# Altium project S7CAS-PLEIADES-CARTE-MERE_P06.PrjPcb (part 4 of 4)

## Sheet S7CAS-PLEIADES-CARTE-MERE_P06_DAC.SchDoc
size Tabloid; SheetNumber: 17; SheetTotal: 18; Sheet_Name: DAC; Size: 11x17
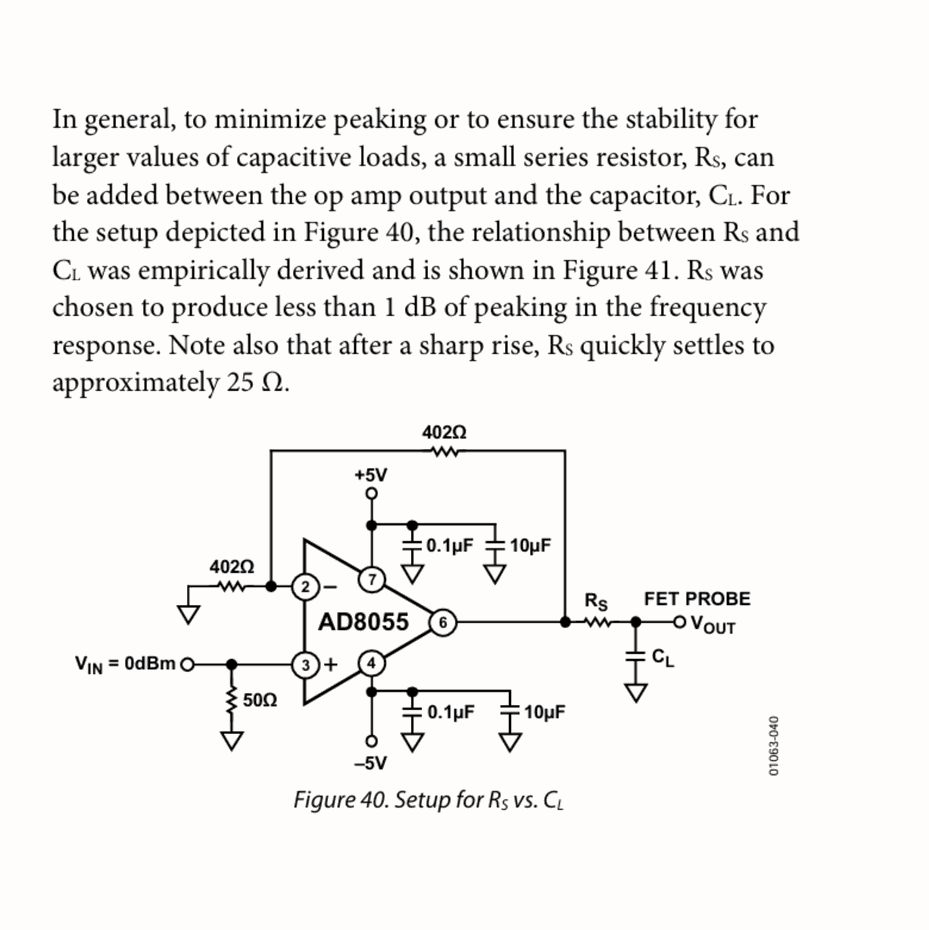
[diagram p50: S7CAS-PLEIADES-CARTE-MERE_P06_DAC.SchDoc, left]
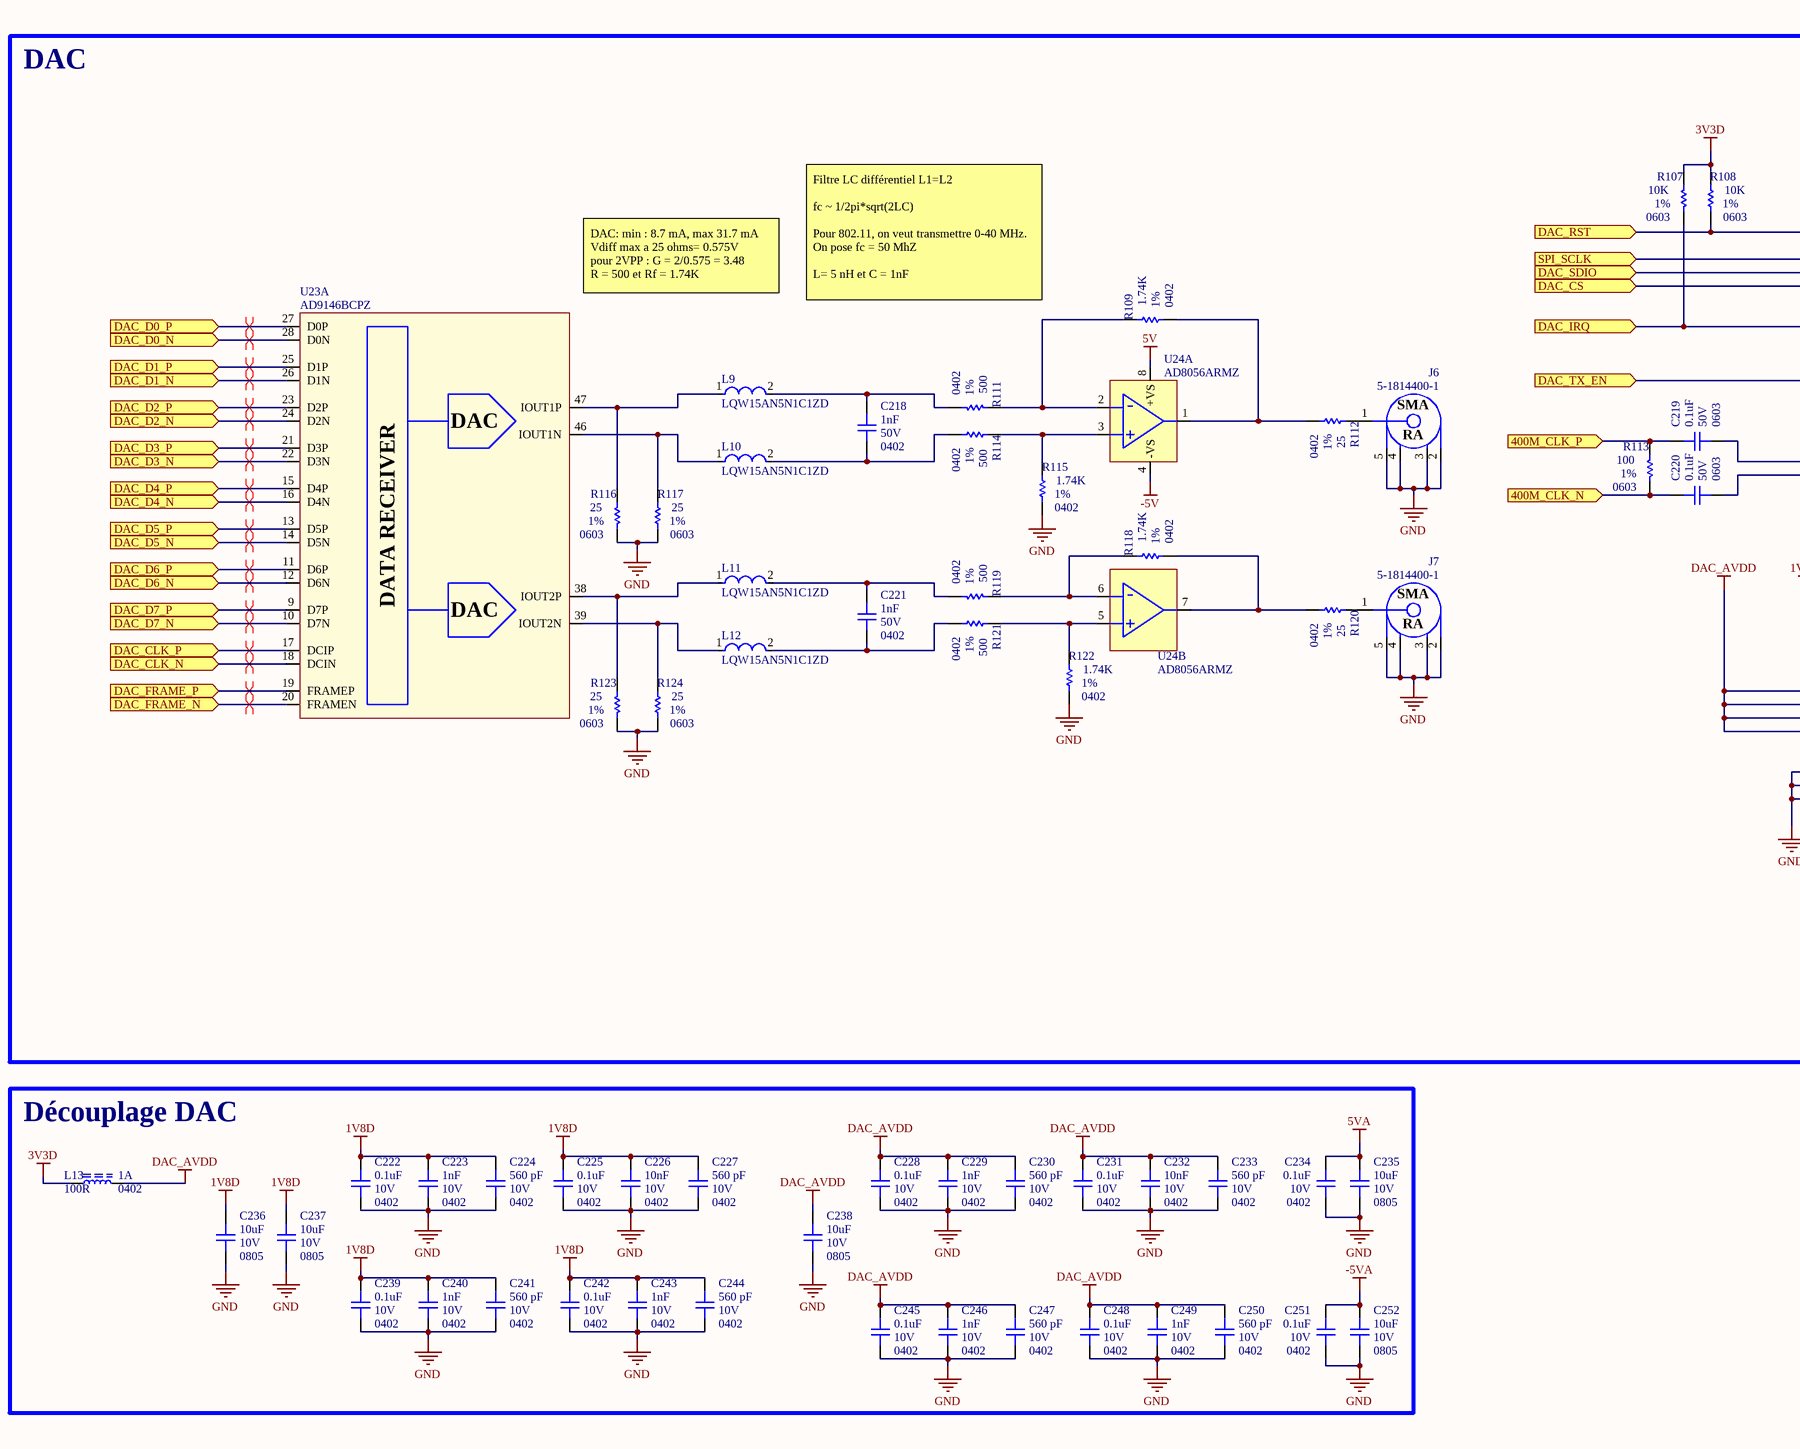
[diagram p51: S7CAS-PLEIADES-CARTE-MERE_P06_DAC.SchDoc, middle]
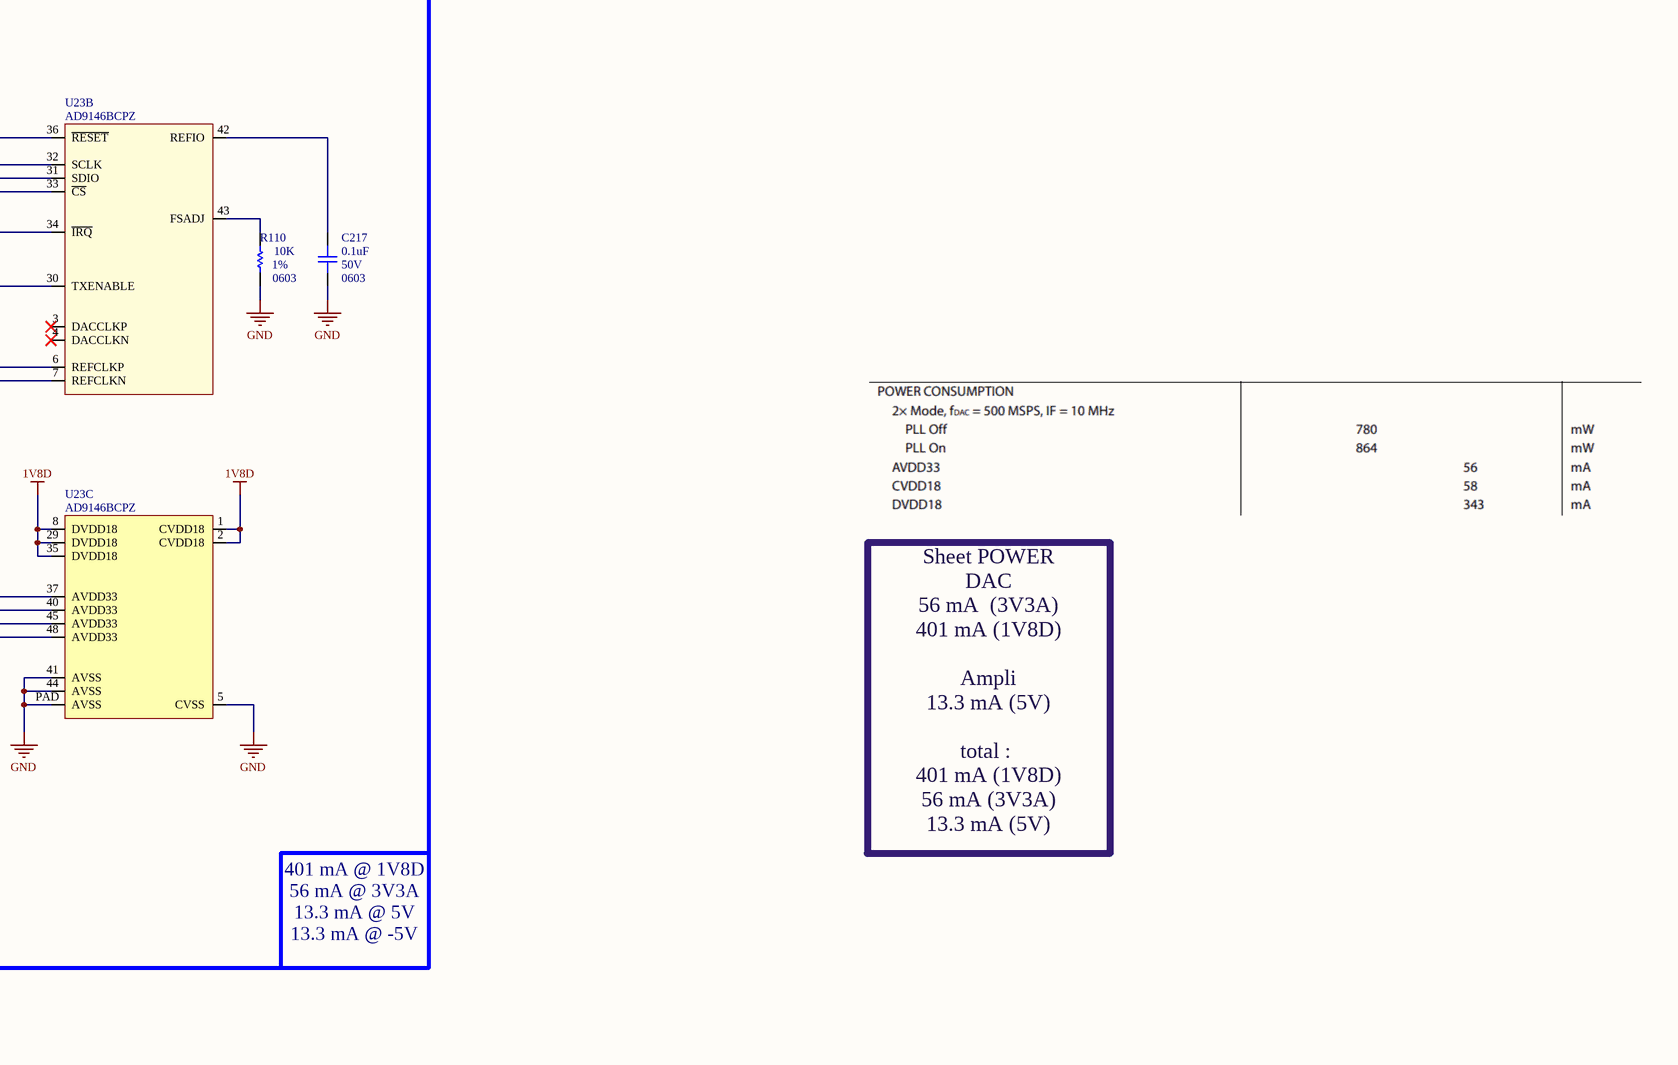
[diagram p52: S7CAS-PLEIADES-CARTE-MERE_P06_DAC.SchDoc, right]

### Parts
C217  value 0.1uF  Voltage: 50V  Package: 0603  [CAP_0603]  (hidden comment: CAP - 0603)
C218  value 1nF  Voltage: 50V  Package: 0402  [CAP_0402]  (hidden comment: CAP - 0402)
C219  value 0.1uF  Voltage: 50V  Package: 0603  [CAP_0603]  (hidden comment: CAP - 0603)
C220  value 0.1uF  Voltage: 50V  Package: 0603  [CAP_0603]  (hidden comment: CAP - 0603)
C221  value 1nF  Voltage: 50V  Package: 0402  [CAP_0402]  (hidden comment: CAP - 0402)
C222  value 0.1uF  Voltage: 10V  Package: 0402  [CAP_0402]  (hidden comment: CAP - 0402)
C223  value 1nF  Voltage: 10V  Package: 0402  [CAP_0402]  (hidden comment: CAP - 0402)
C224  value 560 pF  Voltage: 10V  Package: 0402  [CAP_0402]  (hidden comment: CAP - 0402)
C225  value 0.1uF  Voltage: 10V  Package: 0402  [CAP_0402]  (hidden comment: CAP - 0402)
C226  value 10nF  Voltage: 10V  Package: 0402  [CAP_0402]  (hidden comment: CAP - 0402)
C227  value 560 pF  Voltage: 10V  Package: 0402  [CAP_0402]  (hidden comment: CAP - 0402)
C228  value 0.1uF  Voltage: 10V  Package: 0402  [CAP_0402]  (hidden comment: CAP - 0402)
C229  value 1nF  Voltage: 10V  Package: 0402  [CAP_0402]  (hidden comment: CAP - 0402)
C230  value 560 pF  Voltage: 10V  Package: 0402  [CAP_0402]  (hidden comment: CAP - 0402)
C231  value 0.1uF  Voltage: 10V  Package: 0402  [CAP_0402]  (hidden comment: CAP - 0402)
C232  value 10nF  Voltage: 10V  Package: 0402  [CAP_0402]  (hidden comment: CAP - 0402)
C233  value 560 pF  Voltage: 10V  Package: 0402  [CAP_0402]  (hidden comment: CAP - 0402)
C234  value 0.1uF  Voltage: 10V  Package: 0402  [CAP_0402]  (hidden comment: CAP - 0402)
C235  value 10uF  Voltage: 10V  Package: 0805  [CAP_0805]  (hidden comment: CAP - 0805)
C236  value 10uF  Voltage: 10V  Package: 0805  [CAP_0805]  (hidden comment: CAP - 0805)
C237  value 10uF  Voltage: 10V  Package: 0805  [CAP_0805]  (hidden comment: CAP - 0805)
C238  value 10uF  Voltage: 10V  Package: 0805  [CAP_0805]  (hidden comment: CAP - 0805)
C239  value 0.1uF  Voltage: 10V  Package: 0402  [CAP_0402]  (hidden comment: CAP - 0402)
C240  value 1nF  Voltage: 10V  Package: 0402  [CAP_0402]  (hidden comment: CAP - 0402)
C241  value 560 pF  Voltage: 10V  Package: 0402  [CAP_0402]  (hidden comment: CAP - 0402)
C242  value 0.1uF  Voltage: 10V  Package: 0402  [CAP_0402]  (hidden comment: CAP - 0402)
C243  value 1nF  Voltage: 10V  Package: 0402  [CAP_0402]  (hidden comment: CAP - 0402)
C244  value 560 pF  Voltage: 10V  Package: 0402  [CAP_0402]  (hidden comment: CAP - 0402)
C245  value 0.1uF  Voltage: 10V  Package: 0402  [CAP_0402]  (hidden comment: CAP - 0402)
C246  value 1nF  Voltage: 10V  Package: 0402  [CAP_0402]  (hidden comment: CAP - 0402)
C247  value 560 pF  Voltage: 10V  Package: 0402  [CAP_0402]  (hidden comment: CAP - 0402)
C248  value 0.1uF  Voltage: 10V  Package: 0402  [CAP_0402]  (hidden comment: CAP - 0402)
C249  value 1nF  Voltage: 10V  Package: 0402  [CAP_0402]  (hidden comment: CAP - 0402)
C250  value 560 pF  Voltage: 10V  Package: 0402  [CAP_0402]  (hidden comment: CAP - 0402)
C251  value 0.1uF  Voltage: 10V  Package: 0402  [CAP_0402]  (hidden comment: CAP - 0402)
C252  value 10uF  Voltage: 10V  Package: 0805  [CAP_0805]  (hidden comment: CAP - 0805)
J6  5-1814400-1  [CONN_SMA_5-1814400-1]
J7  5-1814400-1  [CONN_SMA_5-1814400-1]
L9  LQW15AN5N1C1ZD  [FP-LQW15AN_00-W0_6-0_1-MFG]
L10  LQW15AN5N1C1ZD  [FP-LQW15AN_00-W0_6-0_1-MFG]
L11  LQW15AN5N1C1ZD  [FP-LQW15AN_00-W0_6-0_1-MFG]
L12  LQW15AN5N1C1ZD  [FP-LQW15AN_00-W0_6-0_1-MFG]
L13  value 100R  Current: 1A  Package: 0402  [FER_0402]  (hidden comment: FER - 0402)
R107  value 10K  Package: 0603  Precision: 1%  [RES_0603]  (hidden comment: RES - 0603)
R108  value 10K  Package: 0603  Precision: 1%  [RES_0603]  (hidden comment: RES - 0603)
R109  value 1.74K  Package: 0402  Precision: 1%  [RES_0402]  (hidden comment: RES - 0402)
R110  value 10K  Package: 0603  Precision: 1%  [RES_0603]  (hidden comment: RES - 0603)
R111  value 500  Package: 0402  Precision: 1%  [RES_0402]  (hidden comment: RES - 0402)
R112  value 25  Package: 0402  Precision: 1%  [RES_0402]  (hidden comment: RES - 0402)
R113  value 100  Package: 0603  Precision: 1%  [RES_0603]  (hidden comment: RES - 0603)
R114  value 500  Package: 0402  Precision: 1%  [RES_0402]  (hidden comment: RES - 0402)
R115  value 1.74K  Package: 0402  Precision: 1%  [RES_0402]  (hidden comment: RES - 0402)
R116  value 25  Package: 0603  Precision: 1%  [RES_0603]  (hidden comment: RES - 0603)
R117  value 25  Package: 0603  Precision: 1%  [RES_0603]  (hidden comment: RES - 0603)
R118  value 1.74K  Package: 0402  Precision: 1%  [RES_0402]  (hidden comment: RES - 0402)
R119  value 500  Package: 0402  Precision: 1%  [RES_0402]  (hidden comment: RES - 0402)
R120  value 25  Package: 0402  Precision: 1%  [RES_0402]  (hidden comment: RES - 0402)
R121  value 500  Package: 0402  Precision: 1%  [RES_0402]  (hidden comment: RES - 0402)
R122  value 1.74K  Package: 0402  Precision: 1%  [RES_0402]  (hidden comment: RES - 0402)
R123  value 25  Package: 0603  Precision: 1%  [RES_0603]  (hidden comment: RES - 0603)
R124  value 25  Package: 0603  Precision: 1%  [RES_0603]  (hidden comment: RES - 0603)
U23  AD9146BCPZ  [DAC_AD9146BCPZ]  (parts A,B,C of 3)
U24  AD8056ARMZ  [OPAMP_AD8056ARMZ]  (parts A,B of 2)

### Blocks framed on the sheet
DAC: C217-C221 J6 J7 L9-L12 R107-R124 U23 U24
Découplage DAC: C222-C252 L13

### Ports
400M_CLK_N (in, see S7CAS-PLEIADES-CARTE-MERE_P06_CLOCK[4B]), 400M_CLK_P (in, see S7CAS-PLEIADES-CARTE-MERE_P06_CLOCK[4A]), DAC_CLK_N (in, see S7CAS-PLEIADES-CARTE-MERE_P06_FPGA1[4B]), DAC_CLK_P (in, see S7CAS-PLEIADES-CARTE-MERE_P06_FPGA1[4B]), DAC_CS (in, see S7CAS-PLEIADES-CARTE-MERE_P06_FPGA3[6B]), DAC_D0_N (in, see S7CAS-PLEIADES-CARTE-MERE_P06_FPGA1[4A]), DAC_D0_P (in, see S7CAS-PLEIADES-CARTE-MERE_P06_FPGA1[4A]), DAC_D1_N (in, see S7CAS-PLEIADES-CARTE-MERE_P06_FPGA1[4A]), DAC_D1_P (in, see S7CAS-PLEIADES-CARTE-MERE_P06_FPGA1[4A]), DAC_D2_N (in, see S7CAS-PLEIADES-CARTE-MERE_P06_FPGA1[4A]), DAC_D2_P (in, see S7CAS-PLEIADES-CARTE-MERE_P06_FPGA1[4A]), DAC_D3_N (in, see S7CAS-PLEIADES-CARTE-MERE_P06_FPGA1[4A]), DAC_D3_P (in, see S7CAS-PLEIADES-CARTE-MERE_P06_FPGA1[4A]), DAC_D4_N (in, see S7CAS-PLEIADES-CARTE-MERE_P06_FPGA1[4A]), DAC_D4_P (in, see S7CAS-PLEIADES-CARTE-MERE_P06_FPGA1[4A]), DAC_D5_N (in, see S7CAS-PLEIADES-CARTE-MERE_P06_FPGA1[4A]), DAC_D5_P (in, see S7CAS-PLEIADES-CARTE-MERE_P06_FPGA1[4A]), DAC_D6_N (in, see S7CAS-PLEIADES-CARTE-MERE_P06_FPGA1[4B]), DAC_D6_P (in, see S7CAS-PLEIADES-CARTE-MERE_P06_FPGA1[4B]), DAC_D7_N (in, see S7CAS-PLEIADES-CARTE-MERE_P06_FPGA1[4B]), DAC_D7_P (in, see S7CAS-PLEIADES-CARTE-MERE_P06_FPGA1[4B]), DAC_FRAME_N (in, see S7CAS-PLEIADES-CARTE-MERE_P06_FPGA1[4B]), DAC_FRAME_P (in, see S7CAS-PLEIADES-CARTE-MERE_P06_FPGA1[4B]), DAC_IRQ (in, see S7CAS-PLEIADES-CARTE-MERE_P06_FPGA3[6B]), DAC_RST (in, see S7CAS-PLEIADES-CARTE-MERE_P06_FPGA3[6A]), DAC_SDIO (in, see S7CAS-PLEIADES-CARTE-MERE_P06_FPGA3[6B]), DAC_TX_EN (in, see S7CAS-PLEIADES-CARTE-MERE_P06_FPGA3[6B]), SPI_SCLK (in, see S7CAS-PLEIADES-CARTE-MERE_P06_FPGA3[6B])

### Nets
1V8D: C222.2 C223.2 C224.2 C225.2 C226.2 C227.2 C236.2 C237.2 C239.2 C240.2 C241.2 C242.2 C243.2 C244.2 U23.1(CVDD18) U23.2(CVDD18) U23.8(DVDD18) U23.29(DVDD18) U23.35(DVDD18)
3V3D: L13.2 R107.2 R108.2
5V: U24.8(+VS)
5VA: C234.2 C235.2
-5V: U24.4(-VS)
-5VA: C251.2 C252.2
DAC_AVDD: C228.2 C229.2 C230.2 C231.2 C232.2 C233.2 C238.2 C245.2 C246.2 C247.2 C248.2 C249.2 C250.2 L13.1 U23.37(AVDD33) U23.40(AVDD33) U23.45(AVDD33) U23.48(AVDD33)
GND: C217.1 C222.1 C223.1 C224.1 C225.1 C226.1 C227.1 C228.1 C229.1 C230.1 C231.1 C232.1 C233.1 C234.1 C235.1 C236.1 C237.1 C238.1 C239.1 C240.1 C241.1 C242.1 C243.1 C244.1 C245.1 C246.1 C247.1 C248.1 C249.1 C250.1 C251.1 C252.1 J6.2 J6.3 J6.4 J6.5 J7.2 J7.3 J7.4 J7.5 R110.1 R115.1 R116.1 R117.1 R122.1 R123.1 R124.1 U23.5(CVSS) U23.41(AVSS) U23.44(AVSS) U23.PAD(AVSS)
400M_CLK_N: C220.2 R113.1 ; port 400M_CLK_N
400M_CLK_P: C219.2 R113.2 ; port 400M_CLK_P
DAC_CLK_N: U23.18(DCIN) ; port DAC_CLK_N
DAC_CLK_P: U23.17(DCIP) ; port DAC_CLK_P
DAC_CS: U23.33(~{CS}) ; port DAC_CS
DAC_D0_N: U23.28(D0N) ; port DAC_D0_N
DAC_D0_P: U23.27(D0P) ; port DAC_D0_P
DAC_D1_N: U23.26(D1N) ; port DAC_D1_N
DAC_D1_P: U23.25(D1P) ; port DAC_D1_P
DAC_D2_N: U23.24(D2N) ; port DAC_D2_N
DAC_D2_P: U23.23(D2P) ; port DAC_D2_P
DAC_D3_N: U23.22(D3N) ; port DAC_D3_N
DAC_D3_P: U23.21(D3P) ; port DAC_D3_P
DAC_D4_N: U23.16(D4N) ; port DAC_D4_N
DAC_D4_P: U23.15(D4P) ; port DAC_D4_P
DAC_D5_N: U23.14(D5N) ; port DAC_D5_N
DAC_D5_P: U23.13(D5P) ; port DAC_D5_P
DAC_D6_N: U23.12(D6N) ; port DAC_D6_N
DAC_D6_P: U23.11(D6P) ; port DAC_D6_P
DAC_D7_N: U23.10(D7N) ; port DAC_D7_N
DAC_D7_P: U23.9(D7P) ; port DAC_D7_P
DAC_FRAME_N: U23.20(FRAMEN) ; port DAC_FRAME_N
DAC_FRAME_P: U23.19(FRAMEP) ; port DAC_FRAME_P
DAC_IRQ: R107.1 U23.34(~{IRQ}) ; port DAC_IRQ
DAC_RST: R108.1 U23.36(~{RESET}) ; port DAC_RST
DAC_SDIO: U23.31(SDIO) ; port DAC_SDIO
DAC_TX_EN: U23.30(TXENABLE) ; port DAC_TX_EN
SPI_SCLK: U23.32(SCLK) ; port SPI_SCLK
NetC217_2: C217.2 U23.42(REFIO)
NetC218_1: C218.1 L10.2 R114.1
NetC218_2: C218.2 L9.2 R111.1
NetC219_1: C219.1 U23.6(REFCLKP)
NetC220_1: C220.1 U23.7(REFCLKN)
NetC221_1: C221.1 L12.2 R121.1
NetC221_2: C221.2 L11.2 R119.1
NetJ6_1: J6.1 R112.2
NetJ7_1: J7.1 R120.2
NetL9_1: L9.1 R116.2 U23.47(IOUT1P)
NetL10_1: L10.1 R117.2 U23.46(IOUT1N)
NetL11_1: L11.1 R123.2 U23.38(IOUT2P)
NetL12_1: L12.1 R124.2 U23.39(IOUT2N)
NetR109_1: R109.1 R112.1 U24.1(OUT1)
NetR109_2: R109.2 R111.2 U24.2(-IN1)
NetR110_2: R110.2 U23.43(FSADJ)
NetR114_2: R114.2 R115.2 U24.3(+IN1)
NetR118_1: R118.1 R120.1 U24.7(OUT2)
NetR118_2: R118.2 R119.2 U24.6(-IN2)
NetR121_2: R121.2 R122.2 U24.5(+IN2)

Not connected (* = marked no-connect by the designer): U23 3(DACCLKP)* 4(DACCLKN)*

### Layout directives
differential pair: DAC_CLK_N, DAC_CLK_P, DAC_D0_N, DAC_D0_P, DAC_D1_N, DAC_D1_P, DAC_D2_N, DAC_D2_P, DAC_D3_N, DAC_D3_P, DAC_D4_N, DAC_D4_P, DAC_D5_N, DAC_D5_P, DAC_D6_N, DAC_D6_P, DAC_D7_N, DAC_D7_P, DAC_FRAME_N, DAC_FRAME_P

### Notes on the sheet
- (near U23) DAC: min : 8.7 mA, max 31.7 mA
  Vdiff max a 25 ohms= 0.575V
  pour 2VPP : G = 2/0.575 = 3.48
  R = 500 et Rf = 1.74K
- Filtre LC différentiel L1=L2
  fc ~ 1/2pi*sqrt(2LC)
  Pour 802.11, on veut transmettre 0-40 MHz. On pose fc = 50 MhZ
  L= 5 nH et C = 1nF
- Sheet POWER
  DAC
  56 mA  (3V3A)
  401 mA (1V8D)
  Ampli
  13.3 mA (5V)
  total :
  401 mA (1V8D)
  56 mA (3V3A)
  13.3 mA (5V)
- 401 mA @ 1V8D
  56 mA @ 3V3A
  13.3 mA @ 5V
  13.3 mA @ -5V
- Sheet Name
- Project Title
- Global Project
- Size
- Group
- Revision
- Date
- Sheet
- of
- Filename
- Designers
- (in symbol CONN_SMA_5-1814400-1) SMA; RA
- (in symbol DAC_AD9146BCPZ, part A) DAC; DATA RECEIVER

### Library data of the parts
C217 C219 C220 = CAP - 0603: Precision: 10%; Current: *; CreatedBy: Jonathan Bouchard; Power: *
C218 C221 = CAP - 0402: Mfg Part Number: GCM1555C1H102FA16D; Precision: 1%; Current: *; CreatedBy: Jonathan Bouchard; Power: *
C222-C234 C239-C251 = CAP - 0402: Precision: 10%; Current: *; CreatedBy: Jonathan Bouchard; Power: *
C235-C238 C252 = CAP - 0805: Precision: 10%; Current: *; CreatedBy: Jonathan Bouchard; Power: *
J6 J7 = CONN_SMA_5-1814400-1: CONN -  SMA JACK R/A 50 OHM - TH; Mfg: TE Connectivity AMP Connectors; Voltage: *; Current: *; Power: *; Mfg Part Number: 5-1814400-1; HelpURL: http://www.te.com/commerce/DocumentDelivery/DDEController?Action=srchrtrv&DocNm=1814400&DocType=Customer+Drawing&DocLang=English; CreatedBy: Jonathan Bouchard; Temperature: -55°C ~ 85°C; Value: *; Precision: *; Package: TH-5; Supplier 1: Digikey; Supplier Part Number 1: A97593-ND
L9-L12 = CMP-06042-006317-1: Wire Wound RF Inductor for Automotive 5.1nH ±0.2nH 800mA 0.051Ω 0402 (1005)
R109 R111 R112 R114 R115 R118-R122 = RES - 0402: Voltage: 50V; Power: 1/16W; Current: *; CreatedBy: Jonathan Bouchard
U23 = DAC_AD9146BCPZ: DAC - 16BIT SRL HIGH SPEED - QFN-48; Voltage: 3.13 V ~ 3.47 V / 1.71 V ~ 1.89 V; Mfg: Analog Devices Inc.; Current: *; Power: *; Mfg Part Number: AD9146BCPZ; HelpURL: http://www.analog.com/media/en/technical-documentation/data-sheets/AD9146.PDF; CreatedBy: Jonathan Bouchard; Temperature: -40°C ~ 85°C; Value: *; Precision: 16 Bit; Package: QFN-48; Supplier 1: Digikey; Supplier Part Number 1: AD9146BCPZ-ND
U24 = OPAMP_AD8056ARMZ: OPAMP - VFB 300MHZ - 8MSOP; Voltage: 8 V ~ 12 V, ±4 V ~ 6 V; Current: 60mA; Mfg: Analog Devices; Power: *; Mfg Part Number: AD8056ARMZ; HelpURL: http://www.analog.com/media/en/technical-documentation/data-sheets/AD8055_8056.pdf; CreatedBy: Jonathan Bouchard; Temperature: -40°C ~ 125°C; Value: *; Precision: *; Package: MSOP-8; Supplier 1: Digikey; Supplier Part Number 1: AD8056ARMZ-REEL7CT-ND
L13 = FER - 0402: Voltage: *; CreatedBy: Jonathan Bouchard; Power: *; Precision: *
R107 R108 R110 R113 R116 R117 R123 R124 = RES - 0603: Current: *; CreatedBy: Jonathan Bouchard

## Sheet S7CAS-PLEIADES-CARTE-MERE_P06_USB_PROGRAMER.SCHDOC
size Tabloid; SheetNumber: 18; SheetTotal: 18; Sheet_Name: USB_PROGRAMMER; Size: 11x17
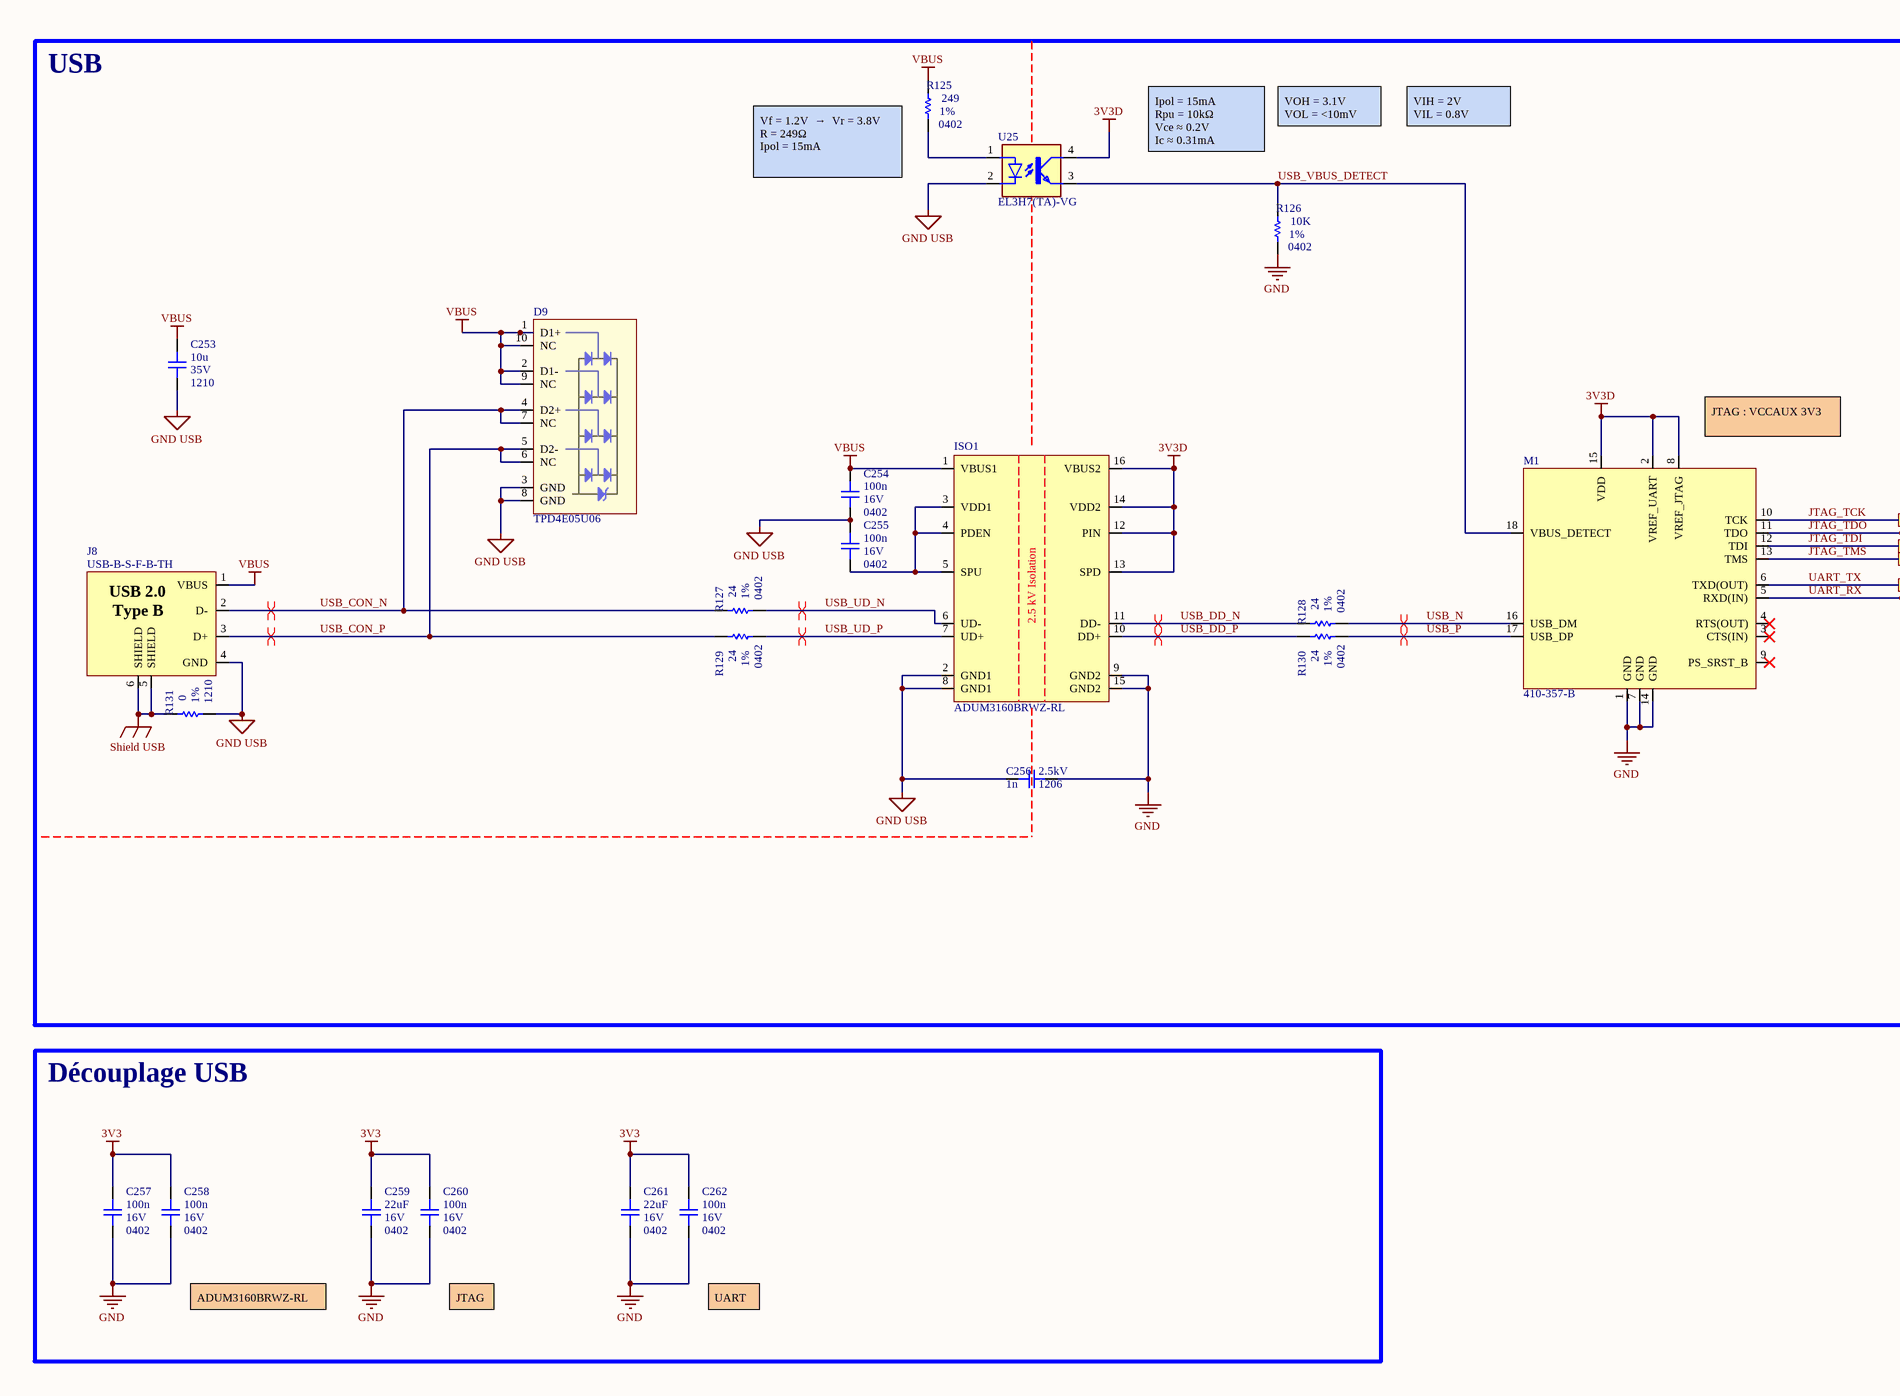
[diagram p53: S7CAS-PLEIADES-CARTE-MERE_P06_USB_PROGRAMER.SCHDOC, left]
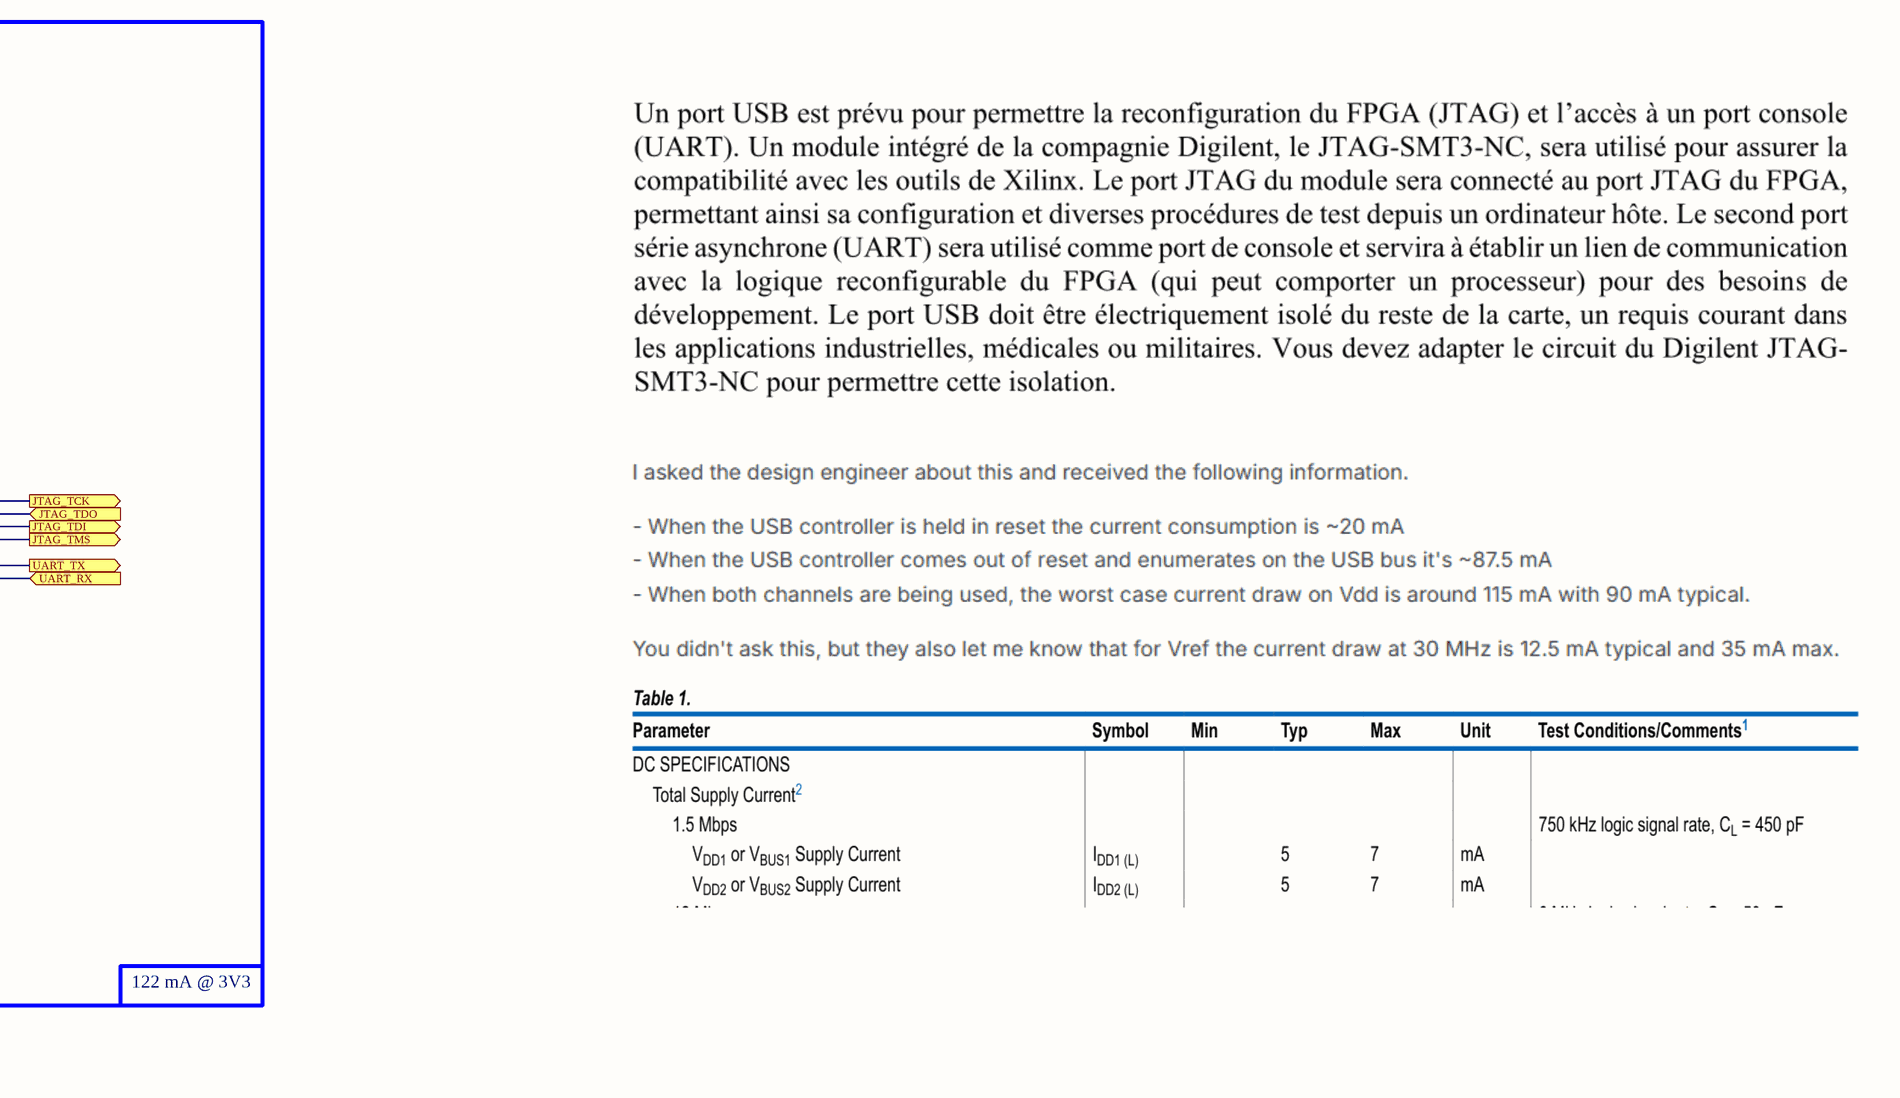
[diagram p54: S7CAS-PLEIADES-CARTE-MERE_P06_USB_PROGRAMER.SCHDOC, right]

### Parts
C253  value 10u  Voltage: 35V  Package: 1210  [CAP_1210]  (hidden comment: CAP - 1210)
C254  value 100n  Voltage: 16V  Package: 0402  [CAP_0402]  (hidden comment: CAP - 0402)
C255  value 100n  Voltage: 16V  Package: 0402  [CAP_0402]  (hidden comment: CAP - 0402)
C256  value 1n  Voltage: 2.5kV  Package: 1206  [CAP_0402]  (hidden comment: CAP - 0402)
C257  value 100n  Voltage: 16V  Package: 0402  [CAP_0402]  (hidden comment: CAP - 0402)
C258  value 100n  Voltage: 16V  Package: 0402  [CAP_0402]  (hidden comment: CAP - 0402)
C259  value 22uF  Voltage: 16V  Package: 0402  [CAP_0402]  (hidden comment: CAP - 0402)
C260  value 100n  Voltage: 16V  Package: 0402  [CAP_0402]  (hidden comment: CAP - 0402)
C261  value 22uF  Voltage: 16V  Package: 0402  [CAP_0402]  (hidden comment: CAP - 0402)
C262  value 100n  Voltage: 16V  Package: 0402  [CAP_0402]  (hidden comment: CAP - 0402)
D9  TPD4E05U06  [TVS_DATA_TPD4E05U06]
ISO1  ADUM3160BRWZ-RL  [ISO_ADUM3160BRWZ-RL]
J8  USB-B-S-F-B-TH  [CON_USB_USB-B-S-F-B-TH]
M1  410-357-B  [MOD_JTAG_410-357-B]
R125  value 249  Package: 0402  Precision: 1%  [RES_0402]  (hidden comment: RES - 0402)
R126  value 10K  Package: 0402  Precision: 1%  [RES_0402]  (hidden comment: RES - 0402)
R127  value 24  Package: 0402  Precision: 1%  [RES_0402]  (hidden comment: RES - 0402)
R128  value 24  Package: 0402  Precision: 1%  [RES_0402]  (hidden comment: RES - 0402)
R129  value 24  Package: 0402  Precision: 1%  [RES_0402]  (hidden comment: RES - 0402)
R130  value 24  Package: 0402  Precision: 1%  [RES_0402]  (hidden comment: RES - 0402)
R131  value 0  Package: 1210  Precision: 1%  [RES_1210]  (hidden comment: RES - 1210)
U25  EL3H7(TA)-VG  [SOIC127P700X200-4N]

### Blocks framed on the sheet
USB: C253-C256 D9 ISO1 J8 M1 R125-R131 U25
Découplage USB: C257-C262

### Ports
JTAG_TCK (out, see S7CAS-PLEIADES-CARTE-MERE_P06_FPGA4[5A]), JTAG_TDI (out, see S7CAS-PLEIADES-CARTE-MERE_P06_FPGA4[5A]), JTAG_TDO (in, see S7CAS-PLEIADES-CARTE-MERE_P06_FPGA4[5A]), JTAG_TMS (out, see S7CAS-PLEIADES-CARTE-MERE_P06_FPGA4[5A]), UART_RX (in, see S7CAS-PLEIADES-CARTE-MERE_P06_FPGA1[3A]), UART_TX (out, see S7CAS-PLEIADES-CARTE-MERE_P06_FPGA1[3A])

### Nets
3V3: C257.2 C258.2 C259.2 C260.2 C261.2 C262.2
3V3D: ISO1.12(PIN) ISO1.13(SPD) ISO1.14(VDD2) ISO1.16(VBUS2) M1.2(VREF_UART) M1.8(VREF_JTAG) M1.15(VDD) U25.4(COL)
GND: C256.1 C257.1 C258.1 C259.1 C260.1 C261.1 C262.1 ISO1.9(GND2) ISO1.15(GND2) M1.1(GND) M1.7(GND) M1.14(GND) R126.1
GND USB: C253.1 C254.1 C255.2 C256.2 D9.3(GND) D9.8(GND) ISO1.2(GND1) ISO1.8(GND1) J8.4(GND) R131.1 U25.2(C)
Shield USB: J8.5(SHIELD) J8.6(SHIELD) R131.2
VBUS: C253.2 C254.2 D9.1(D1+) D9.2(D1-) D9.9(NC) D9.10(NC) ISO1.1(VBUS1) J8.1(VBUS) R125.2
JTAG_TCK: M1.10(TCK) ; port JTAG_TCK
JTAG_TDI: M1.12(TDI) ; port JTAG_TDI
JTAG_TDO: M1.11(TDO) ; port JTAG_TDO
JTAG_TMS: M1.13(TMS) ; port JTAG_TMS
UART_RX: M1.5(RXD(IN)) ; port UART_RX
UART_TX: M1.6(TXD(OUT)) ; port UART_TX
USB_CON_N: D9.4(D2+) D9.7(NC) J8.2(D-) R127.2
USB_CON_P: D9.5(D2-) D9.6(NC) J8.3(D+) R129.2
USB_DD_N: ISO1.11(DD-) R128.2
USB_DD_P: ISO1.10(DD+) R130.2
USB_N: M1.16(USB_DM) R128.1
USB_P: M1.17(USB_DP) R130.1
USB_UD_N: ISO1.6(UD-) R127.1
USB_UD_P: ISO1.7(UD+) R129.1
USB_VBUS_DETECT: M1.18(VBUS_DETECT) R126.2 U25.3(EMIT)
NetC255_1: C255.1 ISO1.3(VDD1) ISO1.4(PDEN) ISO1.5(SPU)
NetR125_1: R125.1 U25.1(A)

Not connected (* = marked no-connect by the designer): M1 3(CTS(IN))* 4(RTS(OUT))* 9(PS_SRST_B)*

### Layout directives
differential pair: USB_CON_N, USB_CON_P
differential pair; differential pair class DIFF_USB: USB_DD_N, USB_DD_P, USB_N, USB_P, USB_UD_N, USB_UD_P

### Notes on the sheet
- Ipol = 15mA
  Rpu = 10kΩ
  Vce ≈ 0.2V
  Ic ≈ 0.31mA
- VOH = 3.1V
  VOL = <10mV
- VIH = 2V
  VIL = 0.8V
- (near R125) Vf = 1.2V  →  Vr = 3.8V
  R = 249Ω
  Ipol = 15mA
- (near M1) JTAG : VCCAUX 3V3
- 122 mA @ 3V3
- ADUM3160BRWZ-RL
- JTAG
- UART
- Sheet Name
- Project Title
- Global Project
- Size
- Group
- Revision
- Date
- Sheet
- of
- Filename
- Designers
- (in symbol CON_USB_USB-B-S-F-B-TH) USB 2.0; Type B
- (in symbol ISO_ADUM3160BRWZ-RL) 2.5 kV Isolation

### Library data of the parts
C253 = CAP - 1210: Precision: 10%; Current: *; CreatedBy: Jonathan Bouchard; Power: *
C254-C262 = CAP - 0402: Precision: 10%; Current: *; CreatedBy: Jonathan Bouchard; Power: *
D9 = TVS_DATA_TPD4E05U06: TVS - TVS DIODE 5.5VWM 14VC - 10SON; Manufacturer #1: Texas Instruments; Part Number #1: TPD4E05U06DQAR; Current Rating: 2.5A (8/20µs); Power Max: 40 W (peak); Value: 4 unidirectionnal channels; Voltage rating: 6V (Breakdown); Polarized: YES; Magnetic Material: UNKNOWN; GRAMS Lib Spec: 2.8; Manufacturer #2: *; Part Number #2: *; HelpURL: http://www.ti.com/lit/ds/symlink/tpd4e05u06.pdf; Supplier 1: Digi-Key; Supplier Part Number 1: 296-35765-1-ND; Note: *; Assembly Type: SMD; Temperature: -40°C ~ 125°C; Package: 10-USON; CreatedBy/Date: Olivier Bernard / 12/3/2018; Tolerance: *; VerifiedBy: Caroline Paulin / 4 juillet 2018; Cryo: UNKNOWN
ISO1 = ISO_ADUM3160BRWZ-RL: ISO - DGTL ISO 2.5KV 2CH USB - 16SOIC; Manufacturer #1: Analog Devices; Value: 2500Vrms voltage isolation; Voltage Rating: 3~5.5V; GRAMS Lib Spec: 2.8; Magnetic Material: UNKNOWN; Polarized: Yes; Tolerance: *; Current Rating: *; Power Max: *; HelpURL: https://www.analog.com/media/en/technical-documentation/data-sheets/ADuM3160.pdf; CreatedBy/Date: Tommy Rossignol 2018-11-16; VerifiedBy: Caroline Paulin - 13 février 2019; Temperature: -40°C ~ 105°C; Package: 16-SOIC; Manufacturer #2: *; Assembly Type: SMD; Part Number #2: *; Part Number #1: ADUM3160BRWZ-RL; Supplier 1: Digi-Key; Supplier Part Number 1: ADUM3160BRWZ-RLCT-ND; Cryo: UNKNOWN
J8 = CON_USB_USB-B-S-F-B-TH: CON - USB B RECPT TH R/A - 4-TH; Manufacturer #1: Samtec Inc.; Value: USB B; Voltage Rating: 30VAC; GRAMS Lib Spec: 2.8c; Magnetic Material: UNKNOWN; Polarized: YES; Tolerance: *; Current Rating: *; Power Max: *; HelpURL: http://suddendocs.samtec.com/catalog_english/usb_b.pdf; CreatedBy/Date: Jonathan Bouchard 2020-03-24; VerifiedBy: C.Paulin - 22/04/2020; Temperature: -50°C ~ 85°C; Package: 4-TH; Manufacturer #2: *; Note: *; Assembly Type: TH; Part Number #2: *; Part Number #1: USB-B-S-F-B-TH; Supplier 1: Digi-Key; Supplier Part Number 1: SAM10867-ND; Cryo: UNKNOWN
M1 = MOD_JTAG_410-357-B: MOD - JTAG-SMT3-NC Programming Module For Xilinx FPGA - 18-SMT; Manufacturer #1: Digilent; Voltage Rating: VDD: 2.97V~3.63V, VJTAG/VUART: 1.65V~5.5V; GRAMS Lib Spec: 2.8; Note: Prior to reflow, the JTAG-SMT3-NC module must be dried at 125°C for 17 hours; Magnetic Material: Unknown; Polarized: Yes; Value: *; Tolerance: *; Current Rating: *; Power Max: *; HelpURL: https://reference.digilentinc.com/_media/reference/programmers/jtag-smt3/jtag-smt3-nc_rm.pdf; CreatedBy/Date: Tommy Rossignol 2018-11-23; VerifiedBy: Nicolas V. (2019-01-28); Temperature: -40°C ~ 85°C; Package: 18-pad SMT; Manufacturer #2: *; Assembly Type: SMD; Part Number #2: *; Part Number #1: 410-357-B; Supplier 1: Digi-Key; Supplier Part Number 1: 1286-1196-ND; Cryo: UNKNOWN
R125-R130 = RES - 0402: Voltage: 50V; Power: 1/16W; Current: *; CreatedBy: Jonathan Bouchard
R131 = RES - 1210: Power: 1/16W; Current: *; CreatedBy: Jonathan Bouchard
U25 = EL3H7(TA)-VG: Optoisolator Transistor Output 3750Vrms 1 Channel 4-SSOP; MF: Everlight Electronics; SnapEDA_Link: https://www.snapeda.com/parts/EL3H7(TA)-VG/Everlight/view-part/?ref=snap; Package: SSOP-4 Everlight; Value: *; MP: EL3H7(TA)-VG; Check_prices: https://www.snapeda.com/parts/EL3H7(TA)-VG/Everlight/view-part/?ref=eda

## Nets that join several sheets
1V2D: S7CAS-PLEIADES-CARTE-MERE_P06_POWER1 (6 pins), S7CAS-PLEIADES-CARTE-MERE_P06_FPGA4 (31 pins), S7CAS-PLEIADES-CARTE-MERE_P06_ETHERNET (C132.2 C133.2 U15.2)
1V5D: S7CAS-PLEIADES-CARTE-MERE_P06_POWER2 (9 pins), S7CAS-PLEIADES-CARTE-MERE_P06_FPGA2 (15 pins), S7CAS-PLEIADES-CARTE-MERE_P06_DDR3 (37 pins)
1V8D: S7CAS-PLEIADES-CARTE-MERE_P06_POWER2 (5 pins), S7CAS-PLEIADES-CARTE-MERE_P06_FPGA3 (10 pins), S7CAS-PLEIADES-CARTE-MERE_P06_ADC (17 pins), S7CAS-PLEIADES-CARTE-MERE_P06_DAC (19 pins)
3V3: S7CAS-PLEIADES-CARTE-MERE_P06_ETHERNET (Y2.4), S7CAS-PLEIADES-CARTE-MERE_P06_USB_PROGRAMER (6 pins)
3V3D: S7CAS-PLEIADES-CARTE-MERE_P06_POWER2 (7 pins), S7CAS-PLEIADES-CARTE-MERE_P06_FPGA1 (31 pins), S7CAS-PLEIADES-CARTE-MERE_P06_FPGA2 (19 pins), S7CAS-PLEIADES-CARTE-MERE_P06_FPGA3 (10 pins), S7CAS-PLEIADES-CARTE-MERE_P06_FPGA4 (30 pins), S7CAS-PLEIADES-CARTE-MERE_P06_CLOCK (17 pins), S7CAS-PLEIADES-CARTE-MERE_P06_ETHERNET (6 pins), S7CAS-PLEIADES-CARTE-MERE_P06_MOTOR (R78.2 R81.2 U19.10), S7CAS-PLEIADES-CARTE-MERE_P06_MISC (14 pins), S7CAS-PLEIADES-CARTE-MERE_P06_ADC (L8.2), S7CAS-PLEIADES-CARTE-MERE_P06_DAC (L13.2 R107.2 R108.2), S7CAS-PLEIADES-CARTE-MERE_P06_USB_PROGRAMER (8 pins)
3V3FLASH: S7CAS-PLEIADES-CARTE-MERE_P06_POWER2 (6 pins), S7CAS-PLEIADES-CARTE-MERE_P06_FLASH (6 pins)
3V6: S7CAS-PLEIADES-CARTE-MERE_P06_POWER1 (C10.1 TP2.1 U2.5 U2.6), S7CAS-PLEIADES-CARTE-MERE_P06_POWER2 (21 pins)
5V: S7CAS-PLEIADES-CARTE-MERE_P06_POWER2 (5 pins), S7CAS-PLEIADES-CARTE-MERE_P06_ADC (11 pins), S7CAS-PLEIADES-CARTE-MERE_P06_DAC (U24.8)
5V8: S7CAS-PLEIADES-CARTE-MERE_P06_POWER1 (16 pins), S7CAS-PLEIADES-CARTE-MERE_P06_POWER2 (C19.2 U5.15 U5.16)
24V: S7CAS-PLEIADES-CARTE-MERE_P06_POWER1 (7 pins), S7CAS-PLEIADES-CARTE-MERE_P06_MOTOR (6 pins), S7CAS-PLEIADES-CARTE-MERE_P06_MISC (R77.2)
-5V: S7CAS-PLEIADES-CARTE-MERE_P06_POWER2 (6 pins), S7CAS-PLEIADES-CARTE-MERE_P06_ADC (9 pins), S7CAS-PLEIADES-CARTE-MERE_P06_DAC (U24.4)
-5V5: S7CAS-PLEIADES-CARTE-MERE_P06_POWER1 (C11.2 TP3.1 U3.5), S7CAS-PLEIADES-CARTE-MERE_P06_POWER2 (C22.2 U6.15 U6.16)
DDR3_VREF: S7CAS-PLEIADES-CARTE-MERE_P06_POWER2 (C39.2 U10.6), S7CAS-PLEIADES-CARTE-MERE_P06_DDR3 (C157.2 C158.2 U16.H1 U16.M8)
DDRVTT: S7CAS-PLEIADES-CARTE-MERE_P06_POWER2 (5 pins), S7CAS-PLEIADES-CARTE-MERE_P06_DDR3 (31 pins)
GND: S7CAS-PLEIADES-CARTE-MERE_P06_POWER1 (39 pins), S7CAS-PLEIADES-CARTE-MERE_P06_POWER2 (55 pins), S7CAS-PLEIADES-CARTE-MERE_P06_FPGA1 (11 pins), S7CAS-PLEIADES-CARTE-MERE_P06_FPGA2 (12 pins), S7CAS-PLEIADES-CARTE-MERE_P06_FPGA3 (8 pins), S7CAS-PLEIADES-CARTE-MERE_P06_FPGA4 (89 pins), S7CAS-PLEIADES-CARTE-MERE_P06_CLOCK (39 pins), S7CAS-PLEIADES-CARTE-MERE_P06_ETHERNET (22 pins), S7CAS-PLEIADES-CARTE-MERE_P06_DDR3 (52 pins), S7CAS-PLEIADES-CARTE-MERE_P06_MOTOR (16 pins), S7CAS-PLEIADES-CARTE-MERE_P06_MISC (9 pins), S7CAS-PLEIADES-CARTE-MERE_P06_FLASH (C180.1 R91.1 U20.4), S7CAS-PLEIADES-CARTE-MERE_P06_ADC (56 pins), S7CAS-PLEIADES-CARTE-MERE_P06_DAC (51 pins), S7CAS-PLEIADES-CARTE-MERE_P06_USB_PROGRAMER (13 pins)
100M_CLK_N: S7CAS-PLEIADES-CARTE-MERE_P06_FPGA1 (U13.A14), S7CAS-PLEIADES-CARTE-MERE_P06_CLOCK (U14.28)
100M_CLK_P: S7CAS-PLEIADES-CARTE-MERE_P06_FPGA1 (U13.B14), S7CAS-PLEIADES-CARTE-MERE_P06_CLOCK (U14.27)
200M_CLK_N: S7CAS-PLEIADES-CARTE-MERE_P06_CLOCK (U14.20), S7CAS-PLEIADES-CARTE-MERE_P06_ADC (C183.2 R92.1)
200M_CLK_P: S7CAS-PLEIADES-CARTE-MERE_P06_CLOCK (U14.19), S7CAS-PLEIADES-CARTE-MERE_P06_ADC (C182.2 R92.2)
400M_CLK_N: S7CAS-PLEIADES-CARTE-MERE_P06_CLOCK (U14.17), S7CAS-PLEIADES-CARTE-MERE_P06_DAC (C220.2 R113.1)
400M_CLK_P: S7CAS-PLEIADES-CARTE-MERE_P06_CLOCK (U14.16), S7CAS-PLEIADES-CARTE-MERE_P06_DAC (C219.2 R113.2)
ADC_CLKOUT_N: S7CAS-PLEIADES-CARTE-MERE_P06_FPGA1 (U13.M21), S7CAS-PLEIADES-CARTE-MERE_P06_ADC (U21.56)
ADC_CLKOUT_P: S7CAS-PLEIADES-CARTE-MERE_P06_FPGA1 (U13.N20), S7CAS-PLEIADES-CARTE-MERE_P06_ADC (U21.57)
ADC_CTRL1: S7CAS-PLEIADES-CARTE-MERE_P06_FPGA3 (U13.H21), S7CAS-PLEIADES-CARTE-MERE_P06_ADC (U21.35)
ADC_CTRL2: S7CAS-PLEIADES-CARTE-MERE_P06_FPGA3 (U13.H22), S7CAS-PLEIADES-CARTE-MERE_P06_ADC (U21.36)
ADC_CTRL3: S7CAS-PLEIADES-CARTE-MERE_P06_FPGA3 (U13.G22), S7CAS-PLEIADES-CARTE-MERE_P06_ADC (U21.37)
ADC_DA0_N: S7CAS-PLEIADES-CARTE-MERE_P06_FPGA1 (U13.R21), S7CAS-PLEIADES-CARTE-MERE_P06_ADC (U21.40)
ADC_DA0_P: S7CAS-PLEIADES-CARTE-MERE_P06_FPGA1 (U13.R22), S7CAS-PLEIADES-CARTE-MERE_P06_ADC (U21.41)
ADC_DA2_N: S7CAS-PLEIADES-CARTE-MERE_P06_FPGA1 (U13.P18), S7CAS-PLEIADES-CARTE-MERE_P06_ADC (U21.42)
ADC_DA2_P: S7CAS-PLEIADES-CARTE-MERE_P06_FPGA1 (U13.P17), S7CAS-PLEIADES-CARTE-MERE_P06_ADC (U21.43)
ADC_DA4_N: S7CAS-PLEIADES-CARTE-MERE_P06_FPGA1 (U13.R19), S7CAS-PLEIADES-CARTE-MERE_P06_ADC (U21.44)
ADC_DA4_P: S7CAS-PLEIADES-CARTE-MERE_P06_FPGA1 (U13.R20), S7CAS-PLEIADES-CARTE-MERE_P06_ADC (U21.45)
ADC_DA6_N: S7CAS-PLEIADES-CARTE-MERE_P06_FPGA1 (U13.R18), S7CAS-PLEIADES-CARTE-MERE_P06_ADC (U21.46)
ADC_DA6_P: S7CAS-PLEIADES-CARTE-MERE_P06_FPGA1 (U13.R17), S7CAS-PLEIADES-CARTE-MERE_P06_ADC (U21.47)
ADC_DA8_N: S7CAS-PLEIADES-CARTE-MERE_P06_FPGA1 (U13.U23), S7CAS-PLEIADES-CARTE-MERE_P06_ADC (U21.50)
ADC_DA8_P: S7CAS-PLEIADES-CARTE-MERE_P06_FPGA1 (U13.T22), S7CAS-PLEIADES-CARTE-MERE_P06_ADC (U21.51)
ADC_DA10_N: S7CAS-PLEIADES-CARTE-MERE_P06_FPGA1 (U13.T19), S7CAS-PLEIADES-CARTE-MERE_P06_ADC (U21.52)
ADC_DA10_P: S7CAS-PLEIADES-CARTE-MERE_P06_FPGA1 (U13.T18), S7CAS-PLEIADES-CARTE-MERE_P06_ADC (U21.53)
ADC_DA12_N: S7CAS-PLEIADES-CARTE-MERE_P06_FPGA1 (U13.U22), S7CAS-PLEIADES-CARTE-MERE_P06_ADC (U21.54)
ADC_DA12_P: S7CAS-PLEIADES-CARTE-MERE_P06_FPGA1 (U13.U21), S7CAS-PLEIADES-CARTE-MERE_P06_ADC (U21.55)
ADC_DB0_N: S7CAS-PLEIADES-CARTE-MERE_P06_FPGA1 (U13.V17), S7CAS-PLEIADES-CARTE-MERE_P06_ADC (U21.60)
ADC_DB0_P: S7CAS-PLEIADES-CARTE-MERE_P06_FPGA1 (U13.U17), S7CAS-PLEIADES-CARTE-MERE_P06_ADC (U21.61)
ADC_DB2_N: S7CAS-PLEIADES-CARTE-MERE_P06_FPGA1 (U13.AA24), S7CAS-PLEIADES-CARTE-MERE_P06_ADC (U21.62)
ADC_DB2_P: S7CAS-PLEIADES-CARTE-MERE_P06_FPGA1 (U13.AA23), S7CAS-PLEIADES-CARTE-MERE_P06_ADC (U21.63)
ADC_DB4_N: S7CAS-PLEIADES-CARTE-MERE_P06_FPGA1 (U13.U20), S7CAS-PLEIADES-CARTE-MERE_P06_ADC (U21.2)
ADC_DB4_P: S7CAS-PLEIADES-CARTE-MERE_P06_FPGA1 (U13.T20), S7CAS-PLEIADES-CARTE-MERE_P06_ADC (U21.3)
ADC_DB6_N: S7CAS-PLEIADES-CARTE-MERE_P06_FPGA1 (U13.AC24), S7CAS-PLEIADES-CARTE-MERE_P06_ADC (U21.4)
ADC_DB6_P: S7CAS-PLEIADES-CARTE-MERE_P06_FPGA1 (U13.AC23), S7CAS-PLEIADES-CARTE-MERE_P06_ADC (U21.5)
ADC_DB8_N: S7CAS-PLEIADES-CARTE-MERE_P06_FPGA1 (U13.V19), S7CAS-PLEIADES-CARTE-MERE_P06_ADC (U21.6)
ADC_DB8_P: S7CAS-PLEIADES-CARTE-MERE_P06_FPGA1 (U13.V18), S7CAS-PLEIADES-CARTE-MERE_P06_ADC (U21.7)
ADC_DB10_N: S7CAS-PLEIADES-CARTE-MERE_P06_FPGA1 (U13.AF25), S7CAS-PLEIADES-CARTE-MERE_P06_ADC (U21.8)
ADC_DB10_P: S7CAS-PLEIADES-CARTE-MERE_P06_FPGA1 (U13.AE24), S7CAS-PLEIADES-CARTE-MERE_P06_ADC (U21.9)
ADC_DB12_N: S7CAS-PLEIADES-CARTE-MERE_P06_FPGA1 (U13.W19), S7CAS-PLEIADES-CARTE-MERE_P06_ADC (U21.10)
ADC_DB12_P: S7CAS-PLEIADES-CARTE-MERE_P06_FPGA1 (U13.W18), S7CAS-PLEIADES-CARTE-MERE_P06_ADC (U21.11)
ADC_Reset: S7CAS-PLEIADES-CARTE-MERE_P06_FPGA3 (U13.C24), S7CAS-PLEIADES-CARTE-MERE_P06_ADC (U21.12)
ADC_SCLK: S7CAS-PLEIADES-CARTE-MERE_P06_FPGA3 (U13.F22), S7CAS-PLEIADES-CARTE-MERE_P06_ADC (U21.13)
ADC_SDATA: S7CAS-PLEIADES-CARTE-MERE_P06_FPGA3 (U13.H20), S7CAS-PLEIADES-CARTE-MERE_P06_ADC (U21.14)
ADC_SDOUT: S7CAS-PLEIADES-CARTE-MERE_P06_FPGA3 (U13.E23), S7CAS-PLEIADES-CARTE-MERE_P06_ADC (U21.64)
ADC_SEN: S7CAS-PLEIADES-CARTE-MERE_P06_FPGA3 (U13.D22), S7CAS-PLEIADES-CARTE-MERE_P06_ADC (U21.15)
BTN0: S7CAS-PLEIADES-CARTE-MERE_P06_FPGA1 (U13.D18), S7CAS-PLEIADES-CARTE-MERE_P06_MISC (C167.2 R67.2)
BTN1: S7CAS-PLEIADES-CARTE-MERE_P06_FPGA1 (U13.C18), S7CAS-PLEIADES-CARTE-MERE_P06_MISC (C168.2 R75.2)
CLOCK_PWRDN: S7CAS-PLEIADES-CARTE-MERE_P06_FPGA2 (U13.Y18), S7CAS-PLEIADES-CARTE-MERE_P06_CLOCK (R32.1)
CLOCK_SPI_CLK: S7CAS-PLEIADES-CARTE-MERE_P06_FPGA2 (U13.AC19), S7CAS-PLEIADES-CARTE-MERE_P06_CLOCK (U14.24)
CLOCK_SPI_LE: S7CAS-PLEIADES-CARTE-MERE_P06_FPGA2 (U13.AA19), S7CAS-PLEIADES-CARTE-MERE_P06_CLOCK (U14.25)
CLOCK_SPI_MISO: S7CAS-PLEIADES-CARTE-MERE_P06_FPGA2 (U13.V16), S7CAS-PLEIADES-CARTE-MERE_P06_CLOCK (U14.22)
CLOCK_SPI_MOSI: S7CAS-PLEIADES-CARTE-MERE_P06_FPGA2 (U13.AD19), S7CAS-PLEIADES-CARTE-MERE_P06_CLOCK (U14.23)
DAC_CLK_N: S7CAS-PLEIADES-CARTE-MERE_P06_FPGA1 (U13.N23), S7CAS-PLEIADES-CARTE-MERE_P06_DAC (U23.18)
DAC_CLK_P: S7CAS-PLEIADES-CARTE-MERE_P06_FPGA1 (U13.N22), S7CAS-PLEIADES-CARTE-MERE_P06_DAC (U23.17)
DAC_CS: S7CAS-PLEIADES-CARTE-MERE_P06_FPGA3 (U13.F26), S7CAS-PLEIADES-CARTE-MERE_P06_DAC (U23.33)
DAC_D0_N: S7CAS-PLEIADES-CARTE-MERE_P06_FPGA1 (U13.L24), S7CAS-PLEIADES-CARTE-MERE_P06_DAC (U23.28)
DAC_D0_P: S7CAS-PLEIADES-CARTE-MERE_P06_FPGA1 (U13.L23), S7CAS-PLEIADES-CARTE-MERE_P06_DAC (U23.27)
DAC_D1_N: S7CAS-PLEIADES-CARTE-MERE_P06_FPGA1 (U13.N21), S7CAS-PLEIADES-CARTE-MERE_P06_DAC (U23.26)
DAC_D1_P: S7CAS-PLEIADES-CARTE-MERE_P06_FPGA1 (U13.P20), S7CAS-PLEIADES-CARTE-MERE_P06_DAC (U23.25)
DAC_D2_N: S7CAS-PLEIADES-CARTE-MERE_P06_FPGA1 (U13.N24), S7CAS-PLEIADES-CARTE-MERE_P06_DAC (U23.24)
DAC_D2_P: S7CAS-PLEIADES-CARTE-MERE_P06_FPGA1 (U13.M23), S7CAS-PLEIADES-CARTE-MERE_P06_DAC (U23.23)
DAC_D3_N: S7CAS-PLEIADES-CARTE-MERE_P06_FPGA1 (U13.K18), S7CAS-PLEIADES-CARTE-MERE_P06_DAC (U23.22)
DAC_D3_P: S7CAS-PLEIADES-CARTE-MERE_P06_FPGA1 (U13.L17), S7CAS-PLEIADES-CARTE-MERE_P06_DAC (U23.21)
DAC_D4_N: S7CAS-PLEIADES-CARTE-MERE_P06_FPGA1 (U13.P26), S7CAS-PLEIADES-CARTE-MERE_P06_DAC (U23.16)
DAC_D4_P: S7CAS-PLEIADES-CARTE-MERE_P06_FPGA1 (U13.P24), S7CAS-PLEIADES-CARTE-MERE_P06_DAC (U23.15)
DAC_D5_N: S7CAS-PLEIADES-CARTE-MERE_P06_FPGA1 (U13.L18), S7CAS-PLEIADES-CARTE-MERE_P06_DAC (U23.14)
DAC_D5_P: S7CAS-PLEIADES-CARTE-MERE_P06_FPGA1 (U13.M19), S7CAS-PLEIADES-CARTE-MERE_P06_DAC (U23.13)
DAC_D6_N: S7CAS-PLEIADES-CARTE-MERE_P06_FPGA1 (U13.R26), S7CAS-PLEIADES-CARTE-MERE_P06_DAC (U23.12)
DAC_D6_P: S7CAS-PLEIADES-CARTE-MERE_P06_FPGA1 (U13.R25), S7CAS-PLEIADES-CARTE-MERE_P06_DAC (U23.11)
DAC_D7_N: S7CAS-PLEIADES-CARTE-MERE_P06_FPGA1 (U13.N19), S7CAS-PLEIADES-CARTE-MERE_P06_DAC (U23.10)
DAC_D7_P: S7CAS-PLEIADES-CARTE-MERE_P06_FPGA1 (U13.M18), S7CAS-PLEIADES-CARTE-MERE_P06_DAC (U23.9)
DAC_FRAME_N: S7CAS-PLEIADES-CARTE-MERE_P06_FPGA1 (U13.N18), S7CAS-PLEIADES-CARTE-MERE_P06_DAC (U23.20)
DAC_FRAME_P: S7CAS-PLEIADES-CARTE-MERE_P06_FPGA1 (U13.N17), S7CAS-PLEIADES-CARTE-MERE_P06_DAC (U23.19)
DAC_IRQ: S7CAS-PLEIADES-CARTE-MERE_P06_FPGA3 (U13.H24), S7CAS-PLEIADES-CARTE-MERE_P06_DAC (R107.1 U23.34)
DAC_RST: S7CAS-PLEIADES-CARTE-MERE_P06_FPGA3 (U13.D24), S7CAS-PLEIADES-CARTE-MERE_P06_DAC (R108.1 U23.36)
DAC_SDIO: S7CAS-PLEIADES-CARTE-MERE_P06_FPGA3 (U13.F24), S7CAS-PLEIADES-CARTE-MERE_P06_DAC (U23.31)
DAC_TX_EN: S7CAS-PLEIADES-CARTE-MERE_P06_FPGA3 (U13.H26), S7CAS-PLEIADES-CARTE-MERE_P06_DAC (U23.30)
DDR3_A0: S7CAS-PLEIADES-CARTE-MERE_P06_FPGA2 (U13.N7), S7CAS-PLEIADES-CARTE-MERE_P06_DDR3 (R42.1 U16.N3)
DDR3_A1: S7CAS-PLEIADES-CARTE-MERE_P06_FPGA2 (U13.N6), S7CAS-PLEIADES-CARTE-MERE_P06_DDR3 (R43.1 U16.P7)
DDR3_A2: S7CAS-PLEIADES-CARTE-MERE_P06_FPGA2 (U13.R9), S7CAS-PLEIADES-CARTE-MERE_P06_DDR3 (R44.1 U16.P3)
DDR3_A3: S7CAS-PLEIADES-CARTE-MERE_P06_FPGA2 (U13.P7), S7CAS-PLEIADES-CARTE-MERE_P06_DDR3 (R45.1 U16.N2)
DDR3_A4: S7CAS-PLEIADES-CARTE-MERE_P06_FPGA2 (U13.N9), S7CAS-PLEIADES-CARTE-MERE_P06_DDR3 (R46.1 U16.P8)
DDR3_A5: S7CAS-PLEIADES-CARTE-MERE_P06_FPGA2 (U13.R2), S7CAS-PLEIADES-CARTE-MERE_P06_DDR3 (R47.1 U16.P2)
DDR3_A6: S7CAS-PLEIADES-CARTE-MERE_P06_FPGA2 (U13.R1), S7CAS-PLEIADES-CARTE-MERE_P06_DDR3 (R48.1 U16.R8)
DDR3_A7: S7CAS-PLEIADES-CARTE-MERE_P06_FPGA2 (U13.P10), S7CAS-PLEIADES-CARTE-MERE_P06_DDR3 (R49.1 U16.R2)
DDR3_A8: S7CAS-PLEIADES-CARTE-MERE_P06_FPGA2 (U13.N4), S7CAS-PLEIADES-CARTE-MERE_P06_DDR3 (R50.1 U16.T8)
DDR3_A9: S7CAS-PLEIADES-CARTE-MERE_P06_FPGA2 (U13.N3), S7CAS-PLEIADES-CARTE-MERE_P06_DDR3 (R51.1 U16.R3)
DDR3_A10: S7CAS-PLEIADES-CARTE-MERE_P06_FPGA2 (U13.M10), S7CAS-PLEIADES-CARTE-MERE_P06_DDR3 (R52.1 U16.L7)
DDR3_A11: S7CAS-PLEIADES-CARTE-MERE_P06_FPGA2 (U13.L3), S7CAS-PLEIADES-CARTE-MERE_P06_DDR3 (R53.1 U16.R7)
DDR3_A12: S7CAS-PLEIADES-CARTE-MERE_P06_FPGA2 (U13.M8), S7CAS-PLEIADES-CARTE-MERE_P06_DDR3 (R54.1 U16.N7)
DDR3_A13: S7CAS-PLEIADES-CARTE-MERE_P06_FPGA2 (U13.M6), S7CAS-PLEIADES-CARTE-MERE_P06_DDR3 (R55.1 U16.T3)
DDR3_BA0: S7CAS-PLEIADES-CARTE-MERE_P06_FPGA2 (U13.P3), S7CAS-PLEIADES-CARTE-MERE_P06_DDR3 (R56.1 U16.M2)
DDR3_BA1: S7CAS-PLEIADES-CARTE-MERE_P06_FPGA2 (U13.P1), S7CAS-PLEIADES-CARTE-MERE_P06_DDR3 (R57.1 U16.N8)
DDR3_BA2: S7CAS-PLEIADES-CARTE-MERE_P06_FPGA2 (U13.N5), S7CAS-PLEIADES-CARTE-MERE_P06_DDR3 (R58.1 U16.M3)
DDR3_CAS: S7CAS-PLEIADES-CARTE-MERE_P06_FPGA2 (U13.P8), S7CAS-PLEIADES-CARTE-MERE_P06_DDR3 (R62.1 U16.K3)
DDR3_CKE0: S7CAS-PLEIADES-CARTE-MERE_P06_FPGA2 (U13.M9), S7CAS-PLEIADES-CARTE-MERE_P06_DDR3 (R59.1 U16.K9)
DDR3_CLK0_N: S7CAS-PLEIADES-CARTE-MERE_P06_FPGA2 (U13.R3), S7CAS-PLEIADES-CARTE-MERE_P06_DDR3 (R65.1 U16.K7)
DDR3_CLK0_P: S7CAS-PLEIADES-CARTE-MERE_P06_FPGA2 (U13.R4), S7CAS-PLEIADES-CARTE-MERE_P06_DDR3 (R65.2 U16.J7)
DDR3_CS: S7CAS-PLEIADES-CARTE-MERE_P06_FPGA2 (U13.L7), S7CAS-PLEIADES-CARTE-MERE_P06_DDR3 (R60.1 U16.L2)
DDR3_DQ0: S7CAS-PLEIADES-CARTE-MERE_P06_FPGA2 (U13.Y3), S7CAS-PLEIADES-CARTE-MERE_P06_DDR3 (U16.E3)
DDR3_DQ1: S7CAS-PLEIADES-CARTE-MERE_P06_FPGA2 (U13.Y1), S7CAS-PLEIADES-CARTE-MERE_P06_DDR3 (U16.F7)
DDR3_DQ2: S7CAS-PLEIADES-CARTE-MERE_P06_FPGA2 (U13.W2), S7CAS-PLEIADES-CARTE-MERE_P06_DDR3 (U16.F2)
DDR3_DQ3: S7CAS-PLEIADES-CARTE-MERE_P06_FPGA2 (U13.W1), S7CAS-PLEIADES-CARTE-MERE_P06_DDR3 (U16.F8)
DDR3_DQ4: S7CAS-PLEIADES-CARTE-MERE_P06_FPGA2 (U13.T3), S7CAS-PLEIADES-CARTE-MERE_P06_DDR3 (U16.H3)
DDR3_DQ5: S7CAS-PLEIADES-CARTE-MERE_P06_FPGA2 (U13.T1), S7CAS-PLEIADES-CARTE-MERE_P06_DDR3 (U16.H8)
DDR3_DQ6: S7CAS-PLEIADES-CARTE-MERE_P06_FPGA2 (U13.U2), S7CAS-PLEIADES-CARTE-MERE_P06_DDR3 (U16.G2)
DDR3_DQ7: S7CAS-PLEIADES-CARTE-MERE_P06_FPGA2 (U13.U1), S7CAS-PLEIADES-CARTE-MERE_P06_DDR3 (U16.H7)
DDR3_DQ8: S7CAS-PLEIADES-CARTE-MERE_P06_FPGA2 (U13.AA2), S7CAS-PLEIADES-CARTE-MERE_P06_DDR3 (U16.D7)
DDR3_DQ9: S7CAS-PLEIADES-CARTE-MERE_P06_FPGA2 (U13.AA1), S7CAS-PLEIADES-CARTE-MERE_P06_DDR3 (U16.C3)
DDR3_DQ10: S7CAS-PLEIADES-CARTE-MERE_P06_FPGA2 (U13.AE2), S7CAS-PLEIADES-CARTE-MERE_P06_DDR3 (U16.C8)
DDR3_DQ11: S7CAS-PLEIADES-CARTE-MERE_P06_FPGA2 (U13.AE1), S7CAS-PLEIADES-CARTE-MERE_P06_DDR3 (U16.C2)
DDR3_DQ12: S7CAS-PLEIADES-CARTE-MERE_P06_FPGA2 (U13.AD3), S7CAS-PLEIADES-CARTE-MERE_P06_DDR3 (U16.A7)
DDR3_DQ13: S7CAS-PLEIADES-CARTE-MERE_P06_FPGA2 (U13.AD1), S7CAS-PLEIADES-CARTE-MERE_P06_DDR3 (U16.A2)
DDR3_DQ14: S7CAS-PLEIADES-CARTE-MERE_P06_FPGA2 (U13.AB3), S7CAS-PLEIADES-CARTE-MERE_P06_DDR3 (U16.B8)
DDR3_DQ15: S7CAS-PLEIADES-CARTE-MERE_P06_FPGA2 (U13.AB1), S7CAS-PLEIADES-CARTE-MERE_P06_DDR3 (U16.A3)
DDR3_LDM: S7CAS-PLEIADES-CARTE-MERE_P06_FPGA2 (U13.W3), S7CAS-PLEIADES-CARTE-MERE_P06_DDR3 (U16.E7)
DDR3_LDQS_N: S7CAS-PLEIADES-CARTE-MERE_P06_FPGA2 (U13.V1), S7CAS-PLEIADES-CARTE-MERE_P06_DDR3 (U16.G3)
DDR3_LDQS_P: S7CAS-PLEIADES-CARTE-MERE_P06_FPGA2 (U13.V3), S7CAS-PLEIADES-CARTE-MERE_P06_DDR3 (U16.F3)
DDR3_ODT: S7CAS-PLEIADES-CARTE-MERE_P06_FPGA2 (U13.P6), S7CAS-PLEIADES-CARTE-MERE_P06_DDR3 (R64.1 U16.K1)
DDR3_RAS: S7CAS-PLEIADES-CARTE-MERE_P06_FPGA2 (U13.N8), S7CAS-PLEIADES-CARTE-MERE_P06_DDR3 (R61.1 U16.J3)
DDR3_RESET: S7CAS-PLEIADES-CARTE-MERE_P06_FPGA2 (U13.L4), S7CAS-PLEIADES-CARTE-MERE_P06_DDR3 (R41.2 U16.T2)
DDR3_UDM: S7CAS-PLEIADES-CARTE-MERE_P06_FPGA2 (U13.V4), S7CAS-PLEIADES-CARTE-MERE_P06_DDR3 (U16.D3)
DDR3_UDQS_N: S7CAS-PLEIADES-CARTE-MERE_P06_FPGA2 (U13.AC1), S7CAS-PLEIADES-CARTE-MERE_P06_DDR3 (U16.B7)
DDR3_UDQS_P: S7CAS-PLEIADES-CARTE-MERE_P06_FPGA2 (U13.AC2), S7CAS-PLEIADES-CARTE-MERE_P06_DDR3 (U16.C7)
DDR3_WE: S7CAS-PLEIADES-CARTE-MERE_P06_FPGA2 (U13.P5), S7CAS-PLEIADES-CARTE-MERE_P06_DDR3 (R63.1 U16.L3)
ETH_COL: S7CAS-PLEIADES-CARTE-MERE_P06_FPGA3 (U13.N1), S7CAS-PLEIADES-CARTE-MERE_P06_ETHERNET (U15.28)
ETH_CRS: S7CAS-PLEIADES-CARTE-MERE_P06_FPGA3 (U13.M3), S7CAS-PLEIADES-CARTE-MERE_P06_ETHERNET (U15.29)
ETH_INTRP: S7CAS-PLEIADES-CARTE-MERE_P06_FPGA3 (U13.M1), S7CAS-PLEIADES-CARTE-MERE_P06_ETHERNET (R35.1 U15.21)
ETH_MDC: S7CAS-PLEIADES-CARTE-MERE_P06_FPGA3 (U13.N2), S7CAS-PLEIADES-CARTE-MERE_P06_ETHERNET (U15.12)
ETH_MDIO: S7CAS-PLEIADES-CARTE-MERE_P06_FPGA3 (U13.L8), S7CAS-PLEIADES-CARTE-MERE_P06_ETHERNET (R34.1 U15.11)
ETH_Reset: S7CAS-PLEIADES-CARTE-MERE_P06_FPGA3 (U13.K8), S7CAS-PLEIADES-CARTE-MERE_P06_ETHERNET (U15.32)
ETH_RXC: S7CAS-PLEIADES-CARTE-MERE_P06_FPGA3 (U13.H3), S7CAS-PLEIADES-CARTE-MERE_P06_ETHERNET (U15.19)
ETH_RXD0: S7CAS-PLEIADES-CARTE-MERE_P06_FPGA3 (U13.K3), S7CAS-PLEIADES-CARTE-MERE_P06_ETHERNET (U15.16)
ETH_RXD1: S7CAS-PLEIADES-CARTE-MERE_P06_FPGA3 (U13.K1), S7CAS-PLEIADES-CARTE-MERE_P06_ETHERNET (U15.15)
ETH_RXD2: S7CAS-PLEIADES-CARTE-MERE_P06_FPGA3 (U13.J2), S7CAS-PLEIADES-CARTE-MERE_P06_ETHERNET (U15.14)
ETH_RXD3: S7CAS-PLEIADES-CARTE-MERE_P06_FPGA3 (U13.J1), S7CAS-PLEIADES-CARTE-MERE_P06_ETHERNET (U15.13)
ETH_RXDV: S7CAS-PLEIADES-CARTE-MERE_P06_FPGA3 (U13.L2), S7CAS-PLEIADES-CARTE-MERE_P06_ETHERNET (U15.18)
ETH_RXER: S7CAS-PLEIADES-CARTE-MERE_P06_FPGA3 (U13.L1), S7CAS-PLEIADES-CARTE-MERE_P06_ETHERNET (U15.20)
ETH_TXC: S7CAS-PLEIADES-CARTE-MERE_P06_FPGA3 (U13.E1), S7CAS-PLEIADES-CARTE-MERE_P06_ETHERNET (U15.22)
ETH_TXD0: S7CAS-PLEIADES-CARTE-MERE_P06_FPGA3 (U13.G1), S7CAS-PLEIADES-CARTE-MERE_P06_ETHERNET (U15.24)
ETH_TXD1: S7CAS-PLEIADES-CARTE-MERE_P06_FPGA3 (U13.F3), S7CAS-PLEIADES-CARTE-MERE_P06_ETHERNET (U15.25)
ETH_TXD2: S7CAS-PLEIADES-CARTE-MERE_P06_FPGA3 (U13.F1), S7CAS-PLEIADES-CARTE-MERE_P06_ETHERNET (U15.26)
ETH_TXD3: S7CAS-PLEIADES-CARTE-MERE_P06_FPGA3 (U13.E2), S7CAS-PLEIADES-CARTE-MERE_P06_ETHERNET (U15.27)
ETH_TXEN: S7CAS-PLEIADES-CARTE-MERE_P06_FPGA3 (U13.H1), S7CAS-PLEIADES-CARTE-MERE_P06_ETHERNET (U15.23)
ETH_TXER: S7CAS-PLEIADES-CARTE-MERE_P06_FPGA3 (U13.G2), S7CAS-PLEIADES-CARTE-MERE_P06_ETHERNET (U15.31)
JTAG_TCK: S7CAS-PLEIADES-CARTE-MERE_P06_FPGA4 (U13.E21), S7CAS-PLEIADES-CARTE-MERE_P06_USB_PROGRAMER (M1.10)
JTAG_TDI: S7CAS-PLEIADES-CARTE-MERE_P06_FPGA4 (U13.F20), S7CAS-PLEIADES-CARTE-MERE_P06_USB_PROGRAMER (M1.12)
JTAG_TDO: S7CAS-PLEIADES-CARTE-MERE_P06_FPGA4 (U13.A24), S7CAS-PLEIADES-CARTE-MERE_P06_USB_PROGRAMER (M1.11)
JTAG_TMS: S7CAS-PLEIADES-CARTE-MERE_P06_FPGA4 (U13.C23), S7CAS-PLEIADES-CARTE-MERE_P06_USB_PROGRAMER (M1.13)
LED0: S7CAS-PLEIADES-CARTE-MERE_P06_FPGA1 (U13.E18), S7CAS-PLEIADES-CARTE-MERE_P06_MISC (D4.K)
LED1: S7CAS-PLEIADES-CARTE-MERE_P06_FPGA1 (U13.E20), S7CAS-PLEIADES-CARTE-MERE_P06_MISC (D5.K)
LED2: S7CAS-PLEIADES-CARTE-MERE_P06_FPGA1 (U13.D20), S7CAS-PLEIADES-CARTE-MERE_P06_MISC (D6.K)
LED3: S7CAS-PLEIADES-CARTE-MERE_P06_FPGA1 (U13.J17), S7CAS-PLEIADES-CARTE-MERE_P06_MISC (D7.K)
MTR_Dir: S7CAS-PLEIADES-CARTE-MERE_P06_FPGA1 (U13.F17), S7CAS-PLEIADES-CARTE-MERE_P06_MOTOR (U19.3)
MTR_Enable: S7CAS-PLEIADES-CARTE-MERE_P06_FPGA1 (U13.C16), S7CAS-PLEIADES-CARTE-MERE_P06_MOTOR (U19.26)
MTR_Home: S7CAS-PLEIADES-CARTE-MERE_P06_FPGA1 (U13.C17), S7CAS-PLEIADES-CARTE-MERE_P06_MOTOR (U19.2)
MTR_Reset: S7CAS-PLEIADES-CARTE-MERE_P06_FPGA1 (U13.D16), S7CAS-PLEIADES-CARTE-MERE_P06_MOTOR (U19.17)
MTR_Sleep: S7CAS-PLEIADES-CARTE-MERE_P06_FPGA1 (U13.G16), S7CAS-PLEIADES-CARTE-MERE_P06_MOTOR (U19.27)
MTR_SR: S7CAS-PLEIADES-CARTE-MERE_P06_FPGA1 (U13.E16), S7CAS-PLEIADES-CARTE-MERE_P06_MOTOR (U19.16)
MTR_Step: S7CAS-PLEIADES-CARTE-MERE_P06_FPGA1 (U13.F15), S7CAS-PLEIADES-CARTE-MERE_P06_MOTOR (U19.19)
MTR_USM0: S7CAS-PLEIADES-CARTE-MERE_P06_FPGA1 (U13.E17), S7CAS-PLEIADES-CARTE-MERE_P06_MOTOR (U19.13)
MTR_USM1: S7CAS-PLEIADES-CARTE-MERE_P06_FPGA1 (U13.F16), S7CAS-PLEIADES-CARTE-MERE_P06_MOTOR (U19.12)
SPI_FLASH_CS: S7CAS-PLEIADES-CARTE-MERE_P06_FPGA2 (U13.AF4), S7CAS-PLEIADES-CARTE-MERE_P06_FLASH (R87.1 U20.1)
SPI_FLASH_MISO: S7CAS-PLEIADES-CARTE-MERE_P06_FPGA2 (U13.AD20), S7CAS-PLEIADES-CARTE-MERE_P06_FLASH (R86.1 U20.5)
SPI_FLASH_MOSI: S7CAS-PLEIADES-CARTE-MERE_P06_FPGA2 (U13.AF20), S7CAS-PLEIADES-CARTE-MERE_P06_FLASH (R88.2)
SPI_FLASH_SCLK: S7CAS-PLEIADES-CARTE-MERE_P06_FPGA2 (U13.AD22), S7CAS-PLEIADES-CARTE-MERE_P06_FLASH (R89.1 R91.2 U20.6)
SPI_SCLK: S7CAS-PLEIADES-CARTE-MERE_P06_FPGA3 (U13.D26), S7CAS-PLEIADES-CARTE-MERE_P06_DAC (U23.32)
TEMP_SCLK: S7CAS-PLEIADES-CARTE-MERE_P06_FPGA1 (U13.H16), S7CAS-PLEIADES-CARTE-MERE_P06_MISC (R68.1 U17.4 U18.4)
TEMP_SDA: S7CAS-PLEIADES-CARTE-MERE_P06_FPGA1 (U13.G17), S7CAS-PLEIADES-CARTE-MERE_P06_MISC (R69.1 U17.5 U18.5)
UART_RX: S7CAS-PLEIADES-CARTE-MERE_P06_FPGA1 (U13.J14), S7CAS-PLEIADES-CARTE-MERE_P06_USB_PROGRAMER (M1.5)
UART_TX: S7CAS-PLEIADES-CARTE-MERE_P06_FPGA1 (R27.1), S7CAS-PLEIADES-CARTE-MERE_P06_USB_PROGRAMER (M1.6)